# EAGLE board PLA_Controller_combined_Gen2_Rev4 (EAGLE 7.7.0)
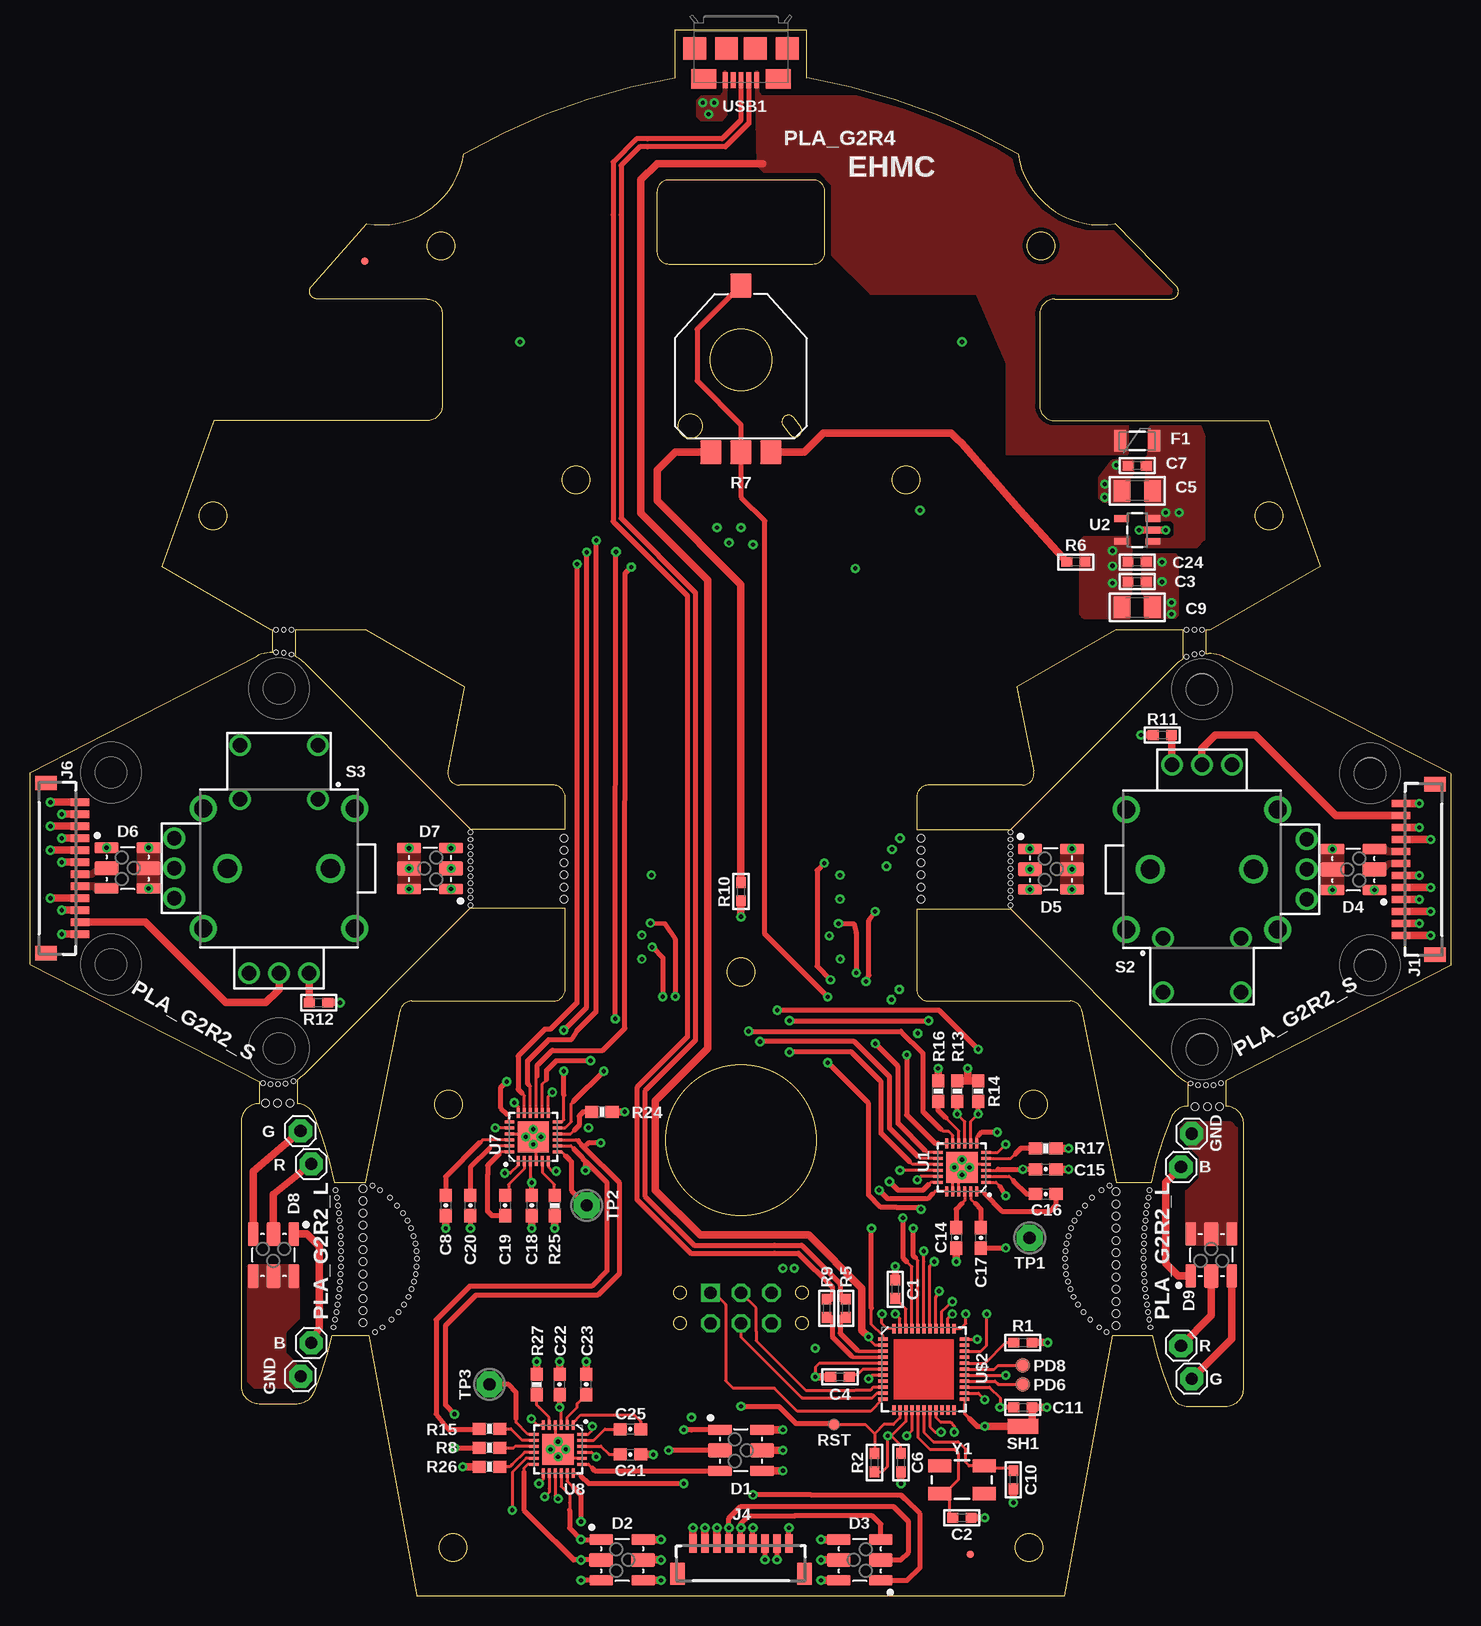
[diagram p6: board, top side]
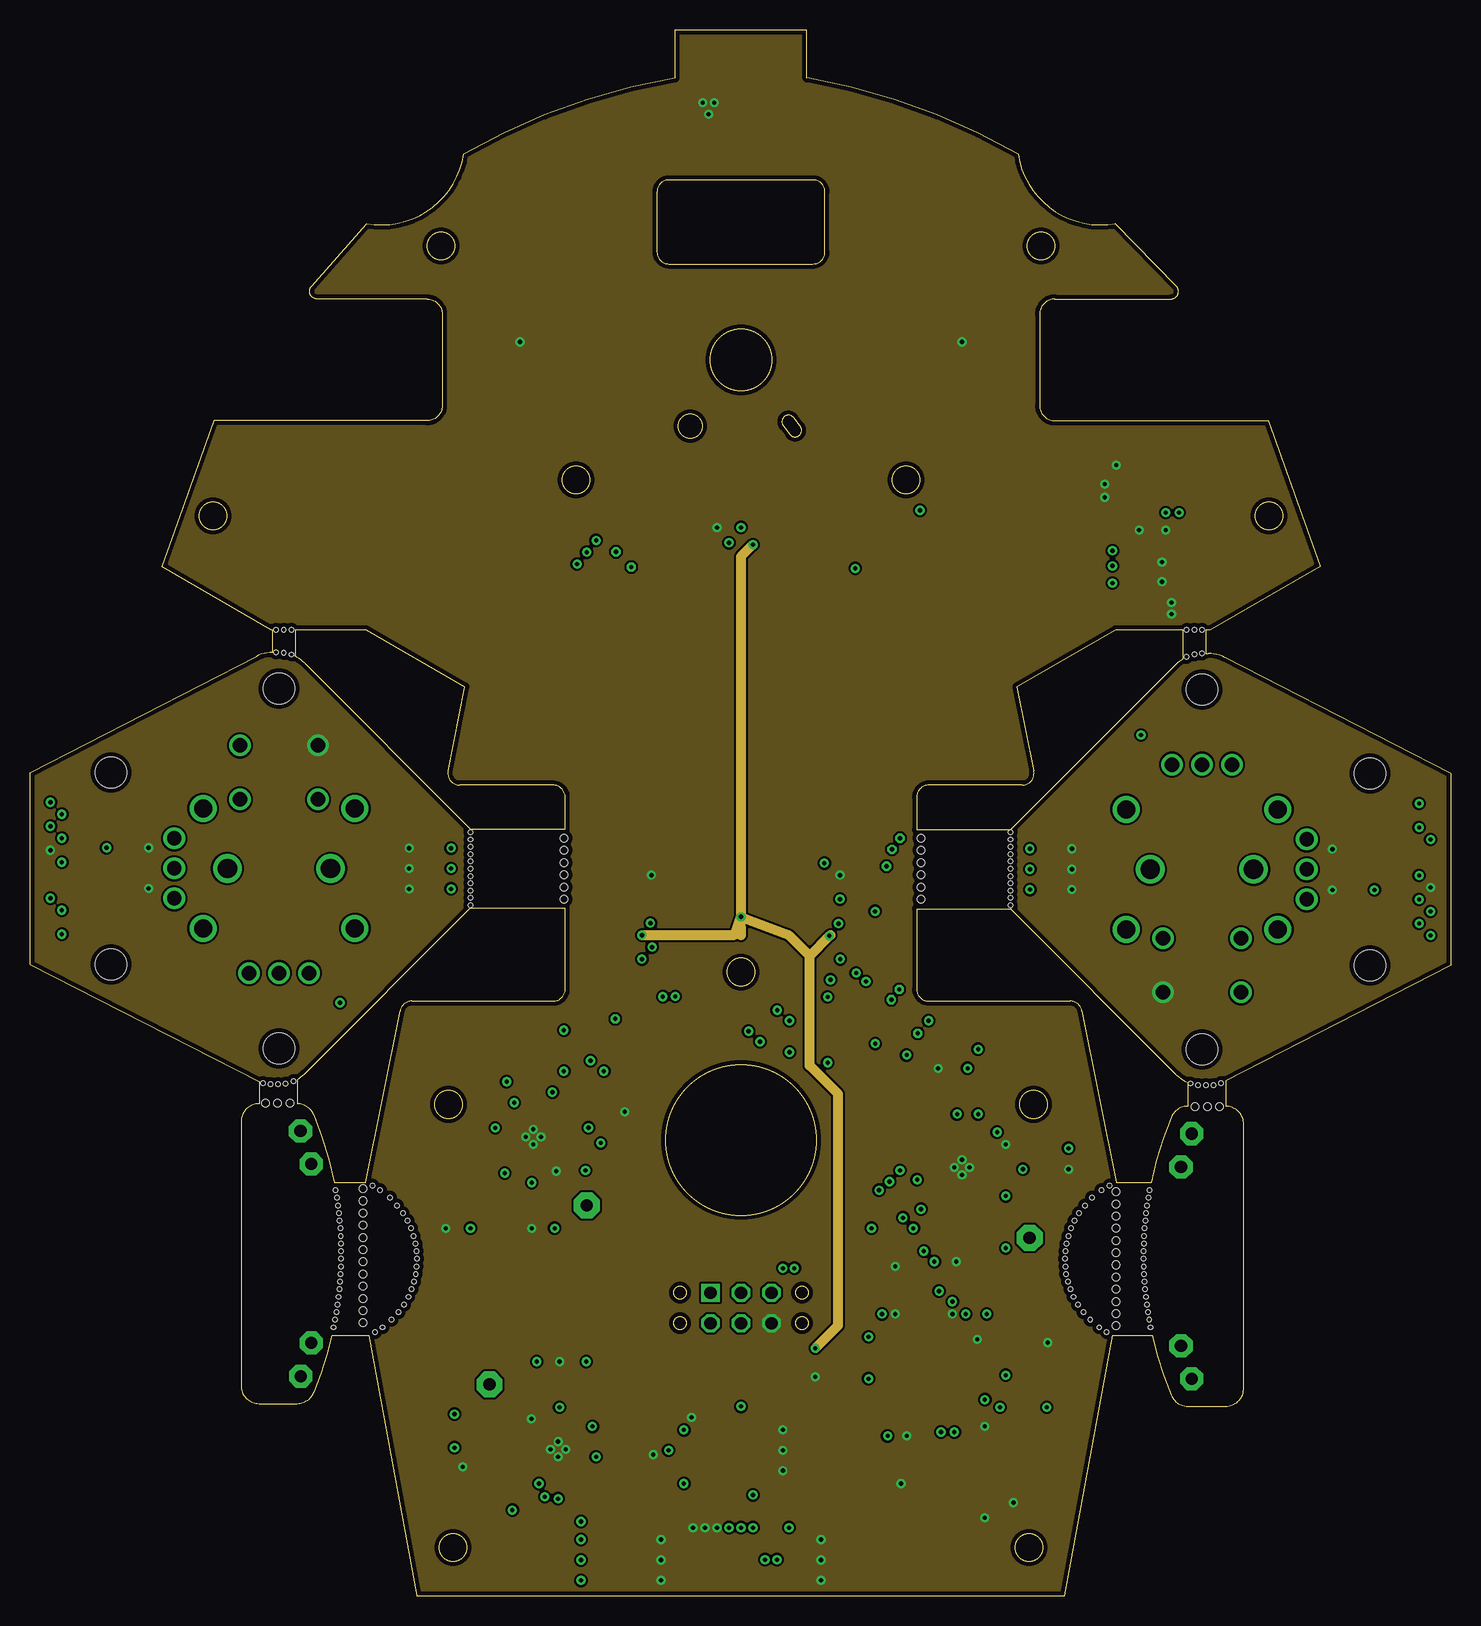
[diagram p7: board, inner layer GND]
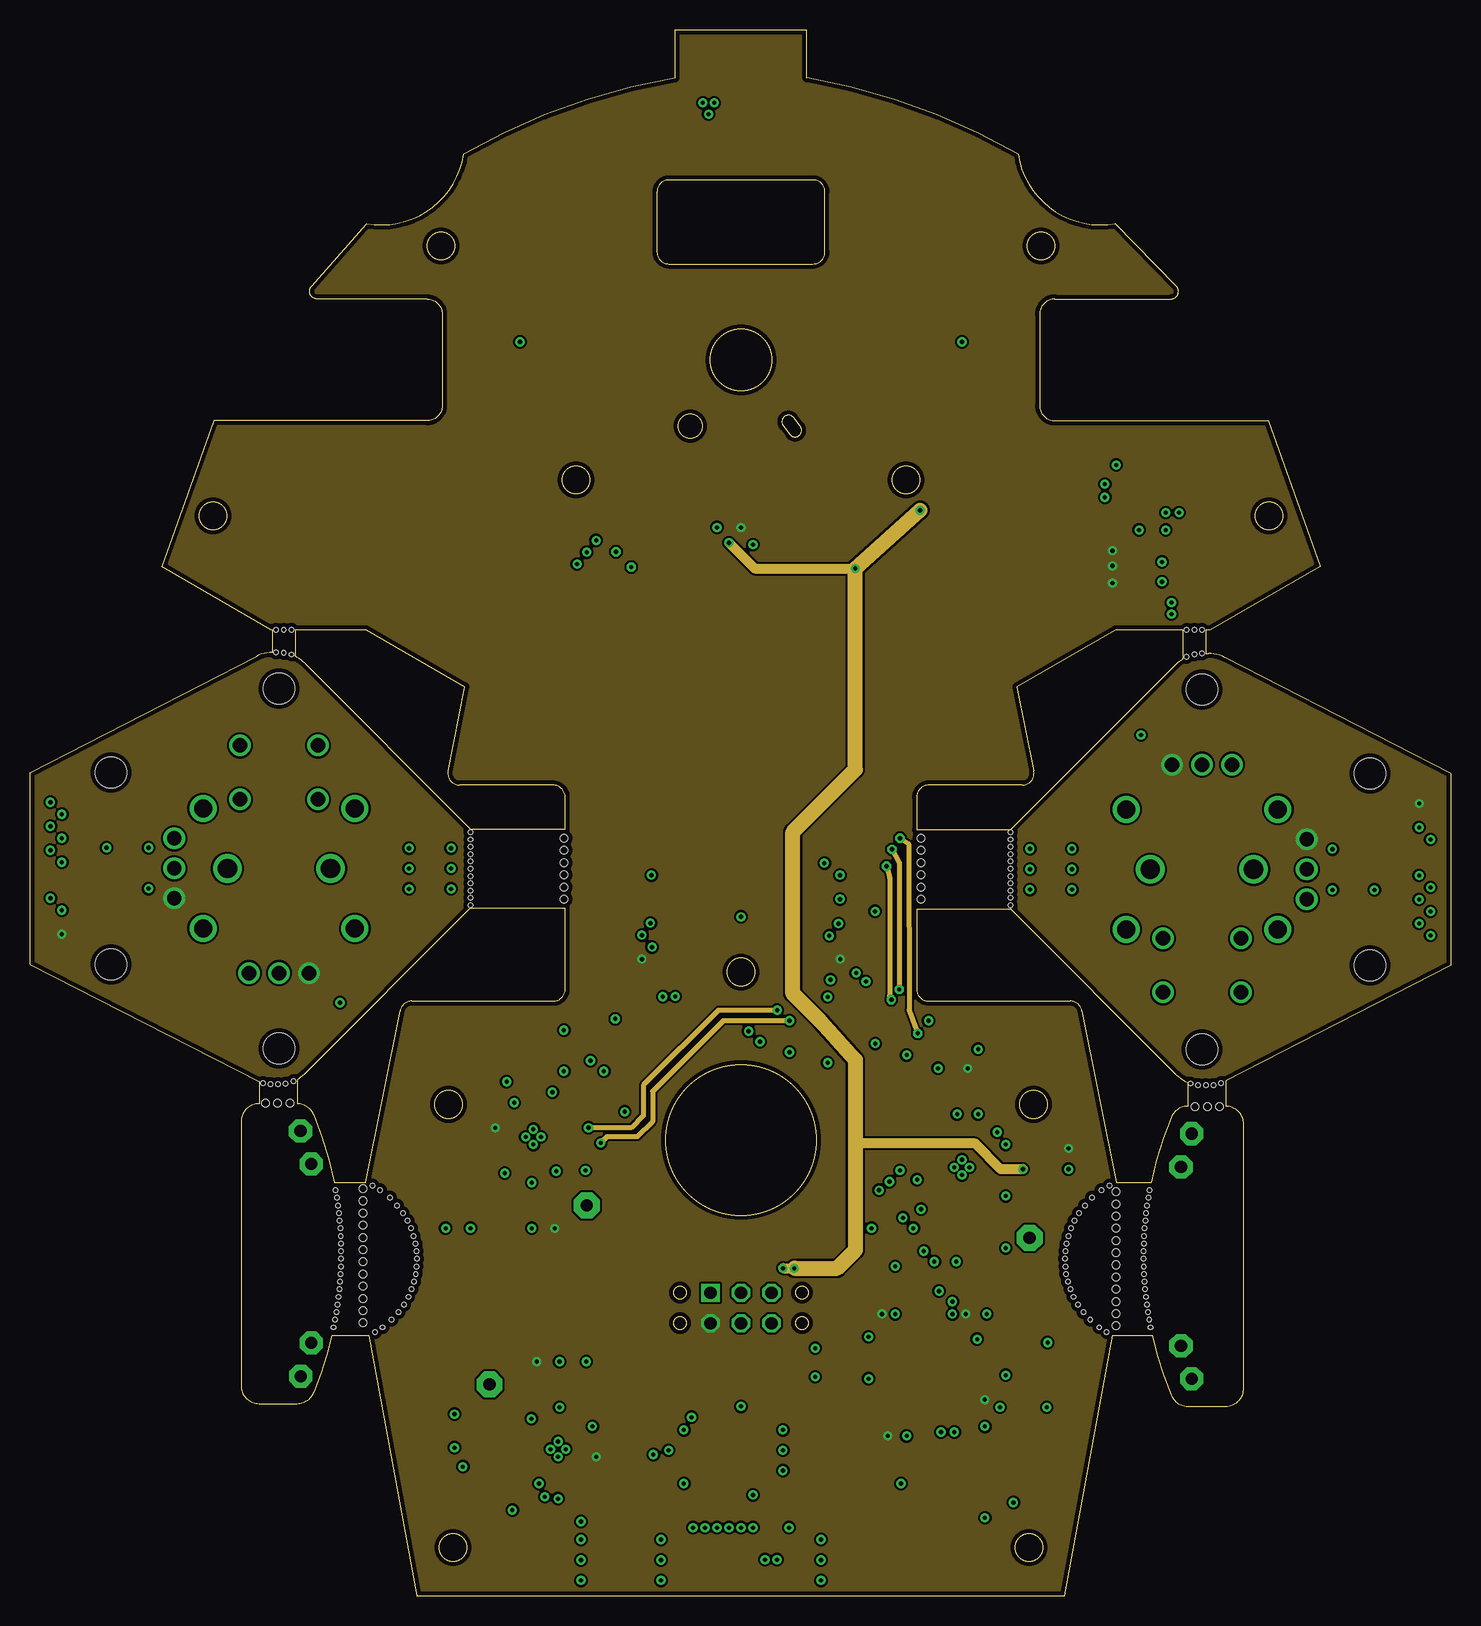
[diagram p8: board, inner layer Route15]
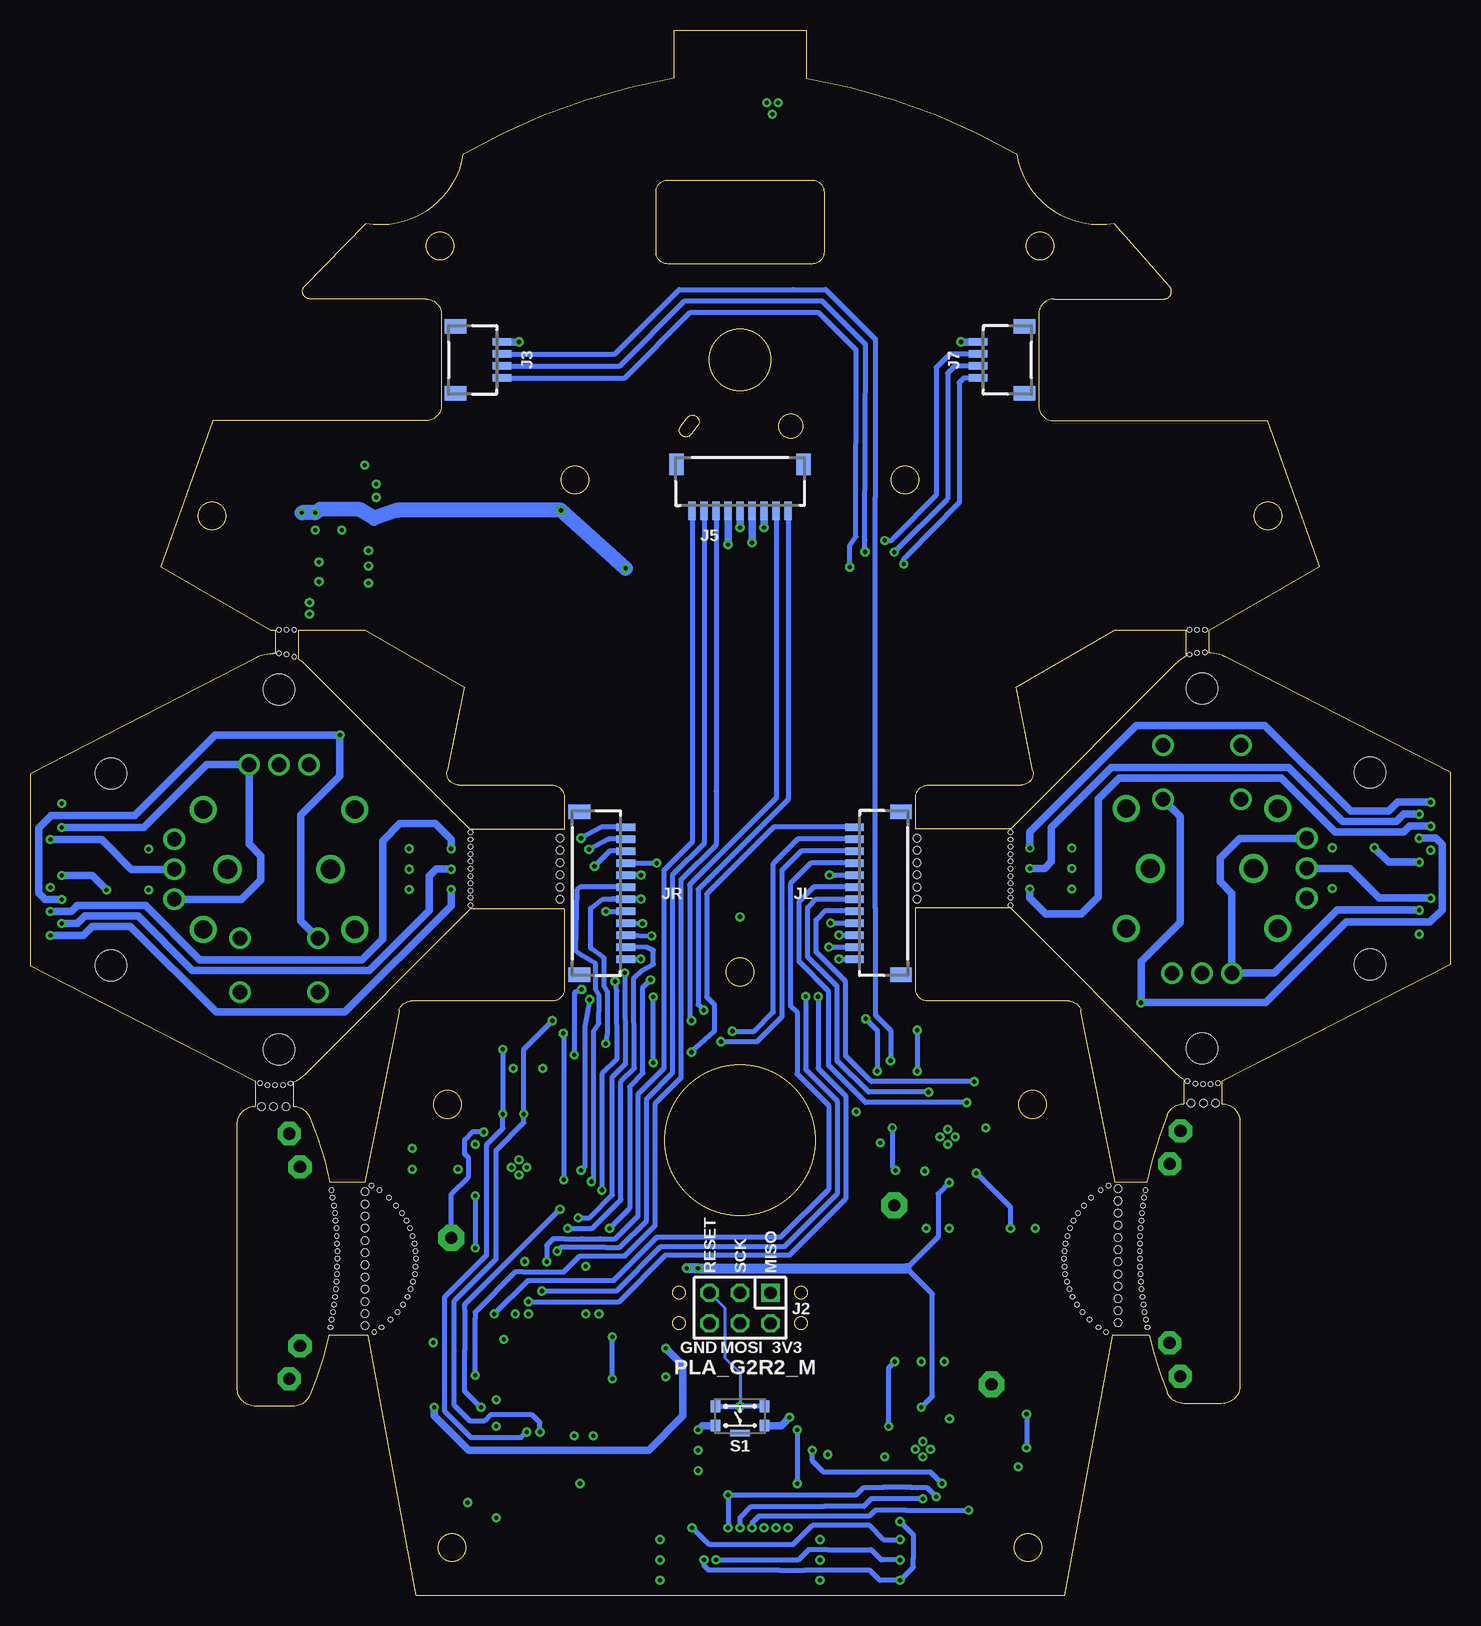
[diagram p9: board, bottom side, seen from below]

Size 118.41 x 130.5 mm. Coordinates in mm from the lower left corner, seen from the top.
Outline: 28.25,21.67 32.25,0 86.25,0 90.25,21.67 93.53,21.67 arc10 95.09,16.71 arc68 96.48,15.78 99.65,15.78 arc90 101.15,17.28 101.15,39.28 arc90 99.65,40.78 99.65,42.91 118.41,52.53 118.41,68.53 99.56,78.2 arc27 98.19,78.53 97.98,78.53 97.98,80.5 98.37,80.5 107.51,85.78 103.19,97.92 85.41,97.92 arc-90 84.14,99.19 84.14,106.81 arc-90 85.41,108.08 95.07,108.08 arc134 95.53,109.16 90.44,114.35 arc-91 82.34,120.13 arc20 64.75,126.5 64.75,130.5 53.75,130.5 53.75,126.5 arc20 36.16,120.13 arc-91 28.05,114.35 23.47,109.16 arc134 23.93,108.08 33.08,108.08 arc-90 34.35,106.81 34.35,99.19 arc-90 33.08,97.92 15.3,97.92 10.98,85.78 20.12,80.5 20.19,80.5 20.19,78.61 arc27 18.86,78.28 0,68.61 0,52.61 19.09,42.84 19.09,40.99 arc90 17.59,39.49 17.59,17.5 arc90 19.09,16 22.26,16 arc68 23.64,16.92 arc10 25.15,21.67 28.25,21.67
Outline: 63.31,96.79 arc180 64.19,97.46 63.64,98.18 arc180 62.77,97.51 63.31,96.79
Outline: 52.25,117 52.25,112 arc90 53.25,111 65.25,111 arc90 66.25,112 66.25,117 arc90 65.25,118 53.25,118 arc90 52.25,117
Outline: 36.25,75.75 28.02,80.5 22.1,80.5 22.1,78.3 arc-18 22.88,77.73 36.7,63.91 44.6,63.91 44.6,66.55 arc90 43.6,67.55 35.82,67.55 arc-101 34.84,68.75 36.25,75.75
Outline: 96.08,80.5 90.47,80.5 82.25,75.75 83.65,68.75 arc-101 82.67,67.55 74.89,67.55 arc90 73.89,66.55 73.89,63.83 81.71,63.83 95.54,77.66 arc-15 96.08,78.08 96.08,80.5
Outline: 73.89,50.55 arc90 74.89,49.55 86.68,49.55 arc-79 87.66,48.75 90.52,34.45 93.43,34.45 arc-11 95.09,39.85 arc-68 96.48,40.78 96.48,42.78 arc-22 95.54,43.41 81.71,57.23 73.89,57.23 73.89,50.55
Outline: 31.82,49.55 arc79 30.84,48.75 27.97,34.45 25.35,34.45 arc11 23.64,40.07 arc68 22.26,40.99 22.26,43.02 arc15 22.88,43.49 36.7,57.31 44.6,57.31 44.6,50.55 arc-90 43.6,49.55 31.82,49.55
Outline: circle at 59.25,103 radius 2.55
Outline: circle at 59.25,37.96 radius 6.25
Outline: circle at 55.02,97.49 radius 1
Outline: circle at 45.5,93 radius 1.15
Outline: circle at 84.25,112.5 radius 1.15
Outline: circle at 103.25,90 radius 1.15
Outline: circle at 15.25,90 radius 1.15
Outline: circle at 83.25,4 radius 1.15
Outline: circle at 59.25,51.97 radius 1.15
Outline: circle at 34.87,40.94 radius 1.15
Outline: circle at 34.25,112.5 radius 1.15
Outline: circle at 35.25,4 radius 1.15
Outline: circle at 83.62,40.94 radius 1.15
Outline: circle at 73,93 radius 1.15
Outline: circle at 64.33,25.23 radius 0.51
Outline: circle at 54.17,25.23 radius 0.51
Outline: circle at 64.33,22.69 radius 0.51
Outline: circle at 54.17,22.69 radius 0.51
Copper layers (1+2*15+16): Top 0.035mm / dielectric 0.3mm / GND 0.035mm / dielectric 0.85mm / Route15 0.035mm / dielectric 0.3mm / Bottom 0.035mm
Design rules "SSC-EAGLE-4Lyr_v1.0.0.3 *": minimum track width 7mil, minimum drill 12mil, track to track 7mil, track to pad 7mil, pad to pad 7mil, via to via 8mil, smd to smd 0mil, copper to edge 15mil, drill to drill 16mil, minimum pad ring 8mil, minimum via ring 8mil, stop-mask expansion 3mil, vias tented up to drill 14mil, thermal gap 10mil
Net classes: 0 default: width 0.203 mm, drill 0.305 mm, clearance 0.178 mm; 1 vcc: width 0.203 mm, drill 0.305 mm, clearance 0.178 mm; 3 diff90: width 0.406 mm, drill 0.356 mm, clearance 0.254 mm
Holes 0.36 mm at 81.71,60.58 81.71,61.19 81.71,61.8 81.71,62.41 81.71,63.02 81.71,63.63 81.71,59.97 81.71,59.36 81.71,58.75 81.71,58.17 81.71,57.53 36.7,63.02 36.7,62.41 36.7,61.8 36.7,61.19 36.7,60.58 36.7,59.97 36.7,59.36 36.7,58.75 36.7,58.17 36.7,57.53 36.7,63.63 20.51,80.5 21.15,80.5 21.78,80.5 20.51,78.62 21.15,78.59 21.78,78.44 97.66,80.5 97.03,80.5 96.39,80.5 97.66,78.54 97.03,78.46 96.39,78.26 96.71,42.69 97.35,42.55 97.98,42.54 98.62,42.56 99.25,42.73 19.4,42.73 20.04,42.62 20.67,42.61 21.31,42.66 21.94,42.87 93.31,33.78 89.31,33.78 88.51,33.15 93.19,33.15 93.09,32.52 87.9,32.52 87.42,31.88 87.05,31.25 86.76,30.61 86.53,29.97 86.37,29.34 86.29,28.7 86.25,28.07 86.27,27.44 86.35,26.8 86.49,26.17 86.7,25.53 86.97,24.89 87.33,24.26 87.78,23.62 88.36,22.99 89.1,22.36 93.02,31.88 92.94,31.25 92.89,30.61 92.85,29.97 92.83,29.34 92.8,28.7 92.8,28.07 92.81,27.44 92.83,26.8 92.88,26.17 92.93,25.53 92.99,24.89 93.07,24.26 93.16,23.62 93.27,22.99 93.38,22.36 25.46,33.78 25.57,33.15 25.66,32.52 25.74,31.88 25.81,31.25 25.86,30.61 25.9,29.97 25.91,29.34 25.93,28.7 25.92,28.07 25.91,27.44 25.88,26.8 25.83,26.17 25.8,25.53 25.72,24.89 25.63,24.26 25.54,23.62 25.43,22.99 25.3,22.36 29.39,22.36 30.14,22.99 30.71,23.62 31.15,24.26 31.52,24.89 31.79,25.53 32.01,26.17 32.15,26.8 32.22,27.44 32.25,28.07 32.21,28.7 32.12,29.34 31.97,29.97 31.74,30.61 31.45,31.25 31.07,31.88 29.99,33.15 29.19,33.78 30.6,32.52 28.53,34.18 28.77,21.96 89.97,34.18 89.73,21.96
Holes 0.61 mm at 27.75,33.91 27.75,32.9 27.75,31.88 27.75,30.86 27.75,29.85 27.75,28.83 27.75,27.82 27.75,26.8 27.75,25.78 27.75,24.77 27.75,23.75 27.75,22.74 90.49,33.66 90.49,32.64 90.49,31.63 90.49,30.61 90.49,29.59 90.49,28.58 90.49,27.56 90.49,26.55 90.49,25.53 90.49,24.51 90.49,23.5 90.49,22.48 97.09,40.77 98.11,40.77 99.12,40.77 19.62,41.02 20.64,41.02 21.65,41.02 44.51,63.12 44.51,62.11 44.51,61.09 44.51,60.07 44.51,59.06 44.51,58.04 74.23,63.12 74.23,62.11 74.23,61.09 74.23,60.07 74.23,59.06 74.23,58.04
bKeepout: area 78,0.1 to 90.2,22.4; area 28.3,0.1 to 40.5,22.4; area 48.5,16.7 to 70,31.2; area 28,31.5 to 39.6,46.5; area 78.9,31.5 to 90.5,46.5; area 11.6,85.5 to 20.8,93.8; area 97.7,85.5 to 106.9,93.8
tRestrict: area -52.6,-44.7 to -51.9,-44.6; area 13.2,88 to 17.2,92; area 101.2,88 to 105.2,92; area 57.2,50 to 61.2,54; area 32.9,38.9 to 36.9,42.9; area 81.6,38.9 to 85.6,42.9; area 81.2,2 to 85.2,6; area 33.2,2 to 37.2,6
bRestrict: area 13.2,88 to 17.2,92; area 101.2,88 to 105.2,92; area 57.2,50 to 61.2,54; area 32.9,38.9 to 36.9,42.9; area 81.6,38.9 to 85.6,42.9; area 81.2,2 to 85.2,6; area 33.2,2 to 37.2,6

## Footprints (pad centres in the part's own frame; a part is rotated, then mirrored left to right if it is on the bottom)
1X01 = drill 1.016 pad 1.93 octagon: 1 0,0
C0603 = smd 0.9 x 0.8: 1 -0.762,0; 2 0.762,0
C1206 = smd 1.4 x 1.8: 1 -1.27,0; 2 1.27,0
0603-CAP = smd 1.1 x 1: 1 -0.85,0; 2 0.85,0
XZFBBM2ACRDG92W-3 = smd 2 x 0.9: 1 -1.75,1.7; 3 -1.75,-1.7; 4 1.75,1.7; 6 1.75,-1.7 | smd 2 x 1.2: 2 -1.75,0; 5 1.75,0
PTC-1206 = smd 1 x 1.8: 1 -1.4,0; 2 1.4,0
SM12B-SSR-H-TB = smd 0.6 x 1.55: 1 -5.5,1.925; 2 -4.5,1.925; 3 -3.5,1.925; 4 -2.5,1.925; 5 -1.5,1.925; 6 -0.5,1.925; 7 0.5,1.925; 8 1.5,1.925; 9 2.5,1.925; 10 3.5,1.925; 11 4.5,1.925; 12 5.5,1.925 | smd 1.2 x 1.8: FIT@1 -7.1,-0.9; FIT@2 7.1,-0.9
DIL-100-2X03 = drill 1.016 square: 1 -2.54,-1.27 | drill 1.016 octagon: 2 -2.54,1.27; 3 0,-1.27; 4 0,1.27; 5 2.54,-1.27; 6 2.54,1.27
SM04B-SRSS-TB = smd 0.6 x 1.55: 1 -1.5,2.975; 2 -0.5,2.975; 3 0.5,2.975; 4 1.5,2.975 | smd 1.2 x 1.8: FIT@1 -2.8,-0.9; FIT@2 2.8,-0.9
BM09B-SRSS-TB = smd 0.6 x 1.55: 1 -4,-1.625; 2 -3,-1.625; 3 -2,-1.625; 4 -1,-1.625; 5 0,-1.625; 6 1,-1.625; 7 2,-1.625; 8 3,-1.625; 9 4,-1.625 | smd 1.2 x 1.8: FIT@1 5.3,0.9; FIT@2 -5.3,0.9
SM09B-SRSS-TB = smd 0.6 x 1.55: 1 -4,2.975; 2 -3,2.975; 3 -2,2.975; 4 -1,2.975; 5 0,2.975; 6 1,2.975; 7 2,2.975; 8 3,2.975; 9 4,2.975 | smd 1.2 x 1.8: FIT@1 -5.3,-0.9; FIT@2 5.3,-0.9
SM12B-SRSS-TB = smd 0.6 x 1.55: 1 -5.5,2.975; 2 -4.5,2.975; 3 -3.5,2.975; 4 -2.5,2.975; 5 -1.5,2.975; 6 -0.5,2.975; 7 0.5,2.975; 8 1.5,2.975; 9 2.5,2.975; 10 3.5,2.975; 11 4.5,2.975; 12 5.5,2.975 | smd 1.2 x 1.8: FIT@1 -6.8,-0.9; FIT@2 6.8,-0.9
MICRO-FIDUCIAL = smd 0.635 x 0.635: 1 0,0
SMD12R = smd 1.2 x 1.2: PAD 0,0
R0603 = smd 0.9 x 0.8: 1 -0.762,0; 2 0.762,0
SV01A103AEA01R00 = smd 1.8 x 2: 1 -2.5,-7.7; 2 0,-7.7; 2A 0,6.2; 3 2.5,-7.7
0603-RES = smd 1.1 x 1: 1 -0.85,0; 2 0.85,0
SMD10R = smd 1 x 1: PAD 0,0
KMR211GLFS = smd 0.9 x 1: 1A -2.05,0.8; 1B 2.05,0.8; 2A -2.05,-0.8; 2B 2.05,-0.8 | smd 1.7 x 0.55: M 0,1.425
RKJXV1224005 = drill 1.2 pad 1.8: 1 -3.25,-5.75; 2 -3.25,-10.25; 3 3.25,-5.75; 4 3.25,-10.25; 5 8.73,-2.5; 6 8.73,0; 7 8.73,2.5; 8 2.5,8.73; 9 0,8.73; 10 -2.5,8.73 | drill 1.5 pad 2.25: 11 -6.325,5; 12 6.325,5; 15 -6.325,-5; 16 6.325,-5 | drill 1.6 pad 2.4: 13 -4.3,0; 14 4.3,0
SHORT_TOP-50 = smd 1.295 x 1.27: 1 0.635,0; 2 -0.635,0
TP-040 = drill 1.016 pad 2.159 octagon: 1 0,0
WQFN-24 = smd 0.8 x 0.25: 1 -2,1.25; 2 -2,0.75; 3 -2,0.25; 4 -2,-0.25; 5 -2,-0.75; 6 -2,-1.25; 13 2,-1.25; 14 2,-0.75; 15 2,-0.25; 16 2,0.25; 17 2,0.75; 18 2,1.25 | smd 0.25 x 0.8: 7 -1.25,-2; 8 -0.75,-2; 9 -0.25,-2; 10 0.25,-2; 11 0.75,-2; 12 1.25,-2; 19 1.25,2; 20 0.75,2; 21 0.25,2; 22 -0.25,2; 23 -0.75,2; 24 -1.25,2 | smd 2.6 x 2.6: EP 0,0
SOT23-5 = smd 0.55 x 1.2: 1 -0.95,-1.3; 2 0,-1.3; 3 0.95,-1.3; 4 0.95,1.3; 5 -0.95,1.3
QFN-44 = smd 0.8 x 0.3: 1 -3.4,2.5; 2 -3.4,2; 3 -3.4,1.5; 4 -3.4,1; 5 -3.4,0.5; 6 -3.4,0; 7 -3.4,-0.5; 8 -3.4,-1; 9 -3.4,-1.5; 10 -3.4,-2; 11 -3.4,-2.5; 23 3.4,-2.5; 24 3.4,-2; 25 3.4,-1.5; 26 3.4,-1; 27 3.4,-0.5; 28 3.4,0; 29 3.4,0.5; 30 3.4,1; 31 3.4,1.5; 32 3.4,2; 33 3.4,2.5 | smd 0.3 x 0.8: 12 -2.5,-3.4; 13 -2,-3.4; 14 -1.5,-3.4; 15 -1,-3.4; 16 -0.5,-3.4; 17 0,-3.4; 18 0.5,-3.4; 19 1,-3.4; 20 1.5,-3.4; 21 2,-3.4; 22 2.5,-3.4; 34 2.5,3.4; 35 2,3.4; 36 1.5,3.4; 37 1,3.4; 38 0.5,3.4; 39 0,3.4; 40 -0.5,3.4; 41 -1,3.4; 42 -1.5,3.4; 43 -2,3.4; 44 -2.5,3.4
101-NS = hole 2.578: 0,0
10118192-0001LF = smd 0.4 x 1.35: 1 -1.3,4.1; 2 -0.65,4.1; 3 0,4.1; 4 0.65,4.1; 5 1.3,4.1 | smd 1.9 x 1.9: M1 -1.2,1.45; M2 1.2,1.45; S1 -3.85,1.45; S2 3.85,1.45 | smd 2.1 x 1.6: S3 -3.1,4; S4 3.1,4
CRYSTAL-SMD-5X3 = smd 1.9 x 1.1: 1 -1.85,-1.15; 2 1.85,-1.15; 3 1.85,1.15; 4 -1.85,1.15

## Placement (x,y rotation side)
B1  [1X01]  23.45,21.05 180 top
B2  [1X01]  95.92,35.72 0 top
C1  0.1uf  [C0603]  72.11,25.53 90 top
C2  22P  [C0603]  77.66,6.48 0 top
C3  1U  [C0603]  92.27,84.51 180 top
C4  1U  [C0603]  67.5,18.23 0 top
C5  10U  [C1206]  92.27,92.09 0 top
C6  1U  [C0603]  72.58,11.08 90 top
C7  4.7U  [C0603]  92.27,94.18 0 top
C8  1.0uF  [0603-CAP]  34.64,32.52 270 top
C9  10U  [C1206]  92.27,82.38 180 top
C10  22P  [C0603]  81.95,9.66 270 top
C11  0.1uf  [C0603]  82.74,15.69 0 top
C14  1.0uF  [0603-CAP]  77.19,29.82 270 top
C15  1.0uF  [0603-CAP]  84.65,35.53 0 top
C16  0.47uf  [0603-CAP]  84.65,33.47 0 top
C17  0.47uf  [0603-CAP]  79.25,29.82 90 top
C18  1.0uF  [0603-CAP]  41.82,32.52 270 top
C19  0.47uf  [0603-CAP]  39.59,32.52 270 top
C20  0.47uf  [0603-CAP]  36.7,32.52 90 top
C21  1.0uF  [0603-CAP]  50.04,11.75 0 top
C22  1.0uF  [0603-CAP]  44.13,17.59 90 top
C23  0.47uf  [0603-CAP]  46.36,17.59 90 top
C24  0.1uf  [C0603]  92.27,86.15 0 top
C25  0.47uf  [0603-CAP]  50.04,13.87 180 top
D1  [XZFBBM2ACRDG92W-3]  59.25,12.11 0 top
D2  [XZFBBM2ACRDG92W-3]  49.35,2.96 0 top
D3  [XZFBBM2ACRDG92W-3]  69.15,2.96 180 top
D4  [XZFBBM2ACRDG92W-3]  110.28,60.52 180 top
D5  [XZFBBM2ACRDG92W-3]  85.07,60.55 0 top
D6  [XZFBBM2ACRDG92W-3]  8.13,60.63 0 top
D7  [XZFBBM2ACRDG92W-3]  33.34,60.6 180 top
D8  [XZFBBM2ACRDG92W-3]  20.29,28.38 270 top
D9  [XZFBBM2ACRDG92W-3]  98.44,28.39 90 top
F1  500mA  [PTC-1206]  92.27,96.24 0 top
G1  [1X01]  22.54,38.72 180 top
G2  [1X01]  96.81,18.07 0 top
GND51  [1X01]  22.56,18.28 180 top
GND54  [1X01]  96.81,38.49 0 top
J1  [SM12B-SSR-H-TB]  116.18,60.52 90 top
J2  [DIL-100-2X03]  59.25,23.96 180 bottom
J3  [SM04B-SRSS-TB]  82.05,103 270 bottom
J4  [BM09B-SRSS-TB]  59.25,2.71 180 top
J5  [SM09B-SRSS-TB]  59.25,93.39 180 bottom
J6  [SM12B-SSR-H-TB]  2.24,60.63 270 top
J7  [SM04B-SRSS-TB]  36.45,103 90 bottom
JL  [SM12B-SRSS-TB]  46.75,58.55 90 bottom
JP1  FIDUCIALUFIDUCIAL  [MICRO-FIDUCIAL]  27.88,111.23 270 top
JP2  FIDUCIALUFIDUCIAL  [MICRO-FIDUCIAL]  78.34,3.45 0 top
JR  [SM12B-SRSS-TB]  71.75,58.55 270 bottom
PD6  PAD-SMD12R  [SMD12R]  82.74,17.59 0 top
PD8  PAD-SMD12R  [SMD12R]  82.74,19.18 0 top
R1  10K  [R0603]  82.74,21.08 0 top
R2  10K  [R0603]  70.38,11.08 90 top
R5  22  [R0603]  67.98,23.94 270 top
R6  220  [R0603]  87.15,86.15 0 top
R7  [SV01A103AEA01R00]  59.25,103 0 top
R8  [0603-RES]  38.29,12.32 180 top
R9  22  [R0603]  66.39,23.94 270 top
R10  220  [R0603]  59.25,58.68 90 top
R11  10K  [R0603]  94.37,71.73 0 top
R12  10K  [R0603]  24.04,49.42 180 top
R13  4.7K  [0603-RES]  77.27,42.04 90 top
R14  4.7K  [0603-RES]  79.01,42.04 90 top
R15  [0603-RES]  38.29,13.91 180 top
R16  150K  [0603-RES]  75.68,42.04 90 top
R17  150K  [0603-RES]  84.65,37.28 0 top
R18  [1X01]  23.44,35.97 180 top
R19  [1X01]  95.92,20.82 0 top
R24  150K  [0603-RES]  47.66,40.33 0 top
R25  150K  [0603-RES]  43.72,32.52 270 top
R26  150K  [0603-RES]  38.29,10.73 180 top
R27  150K  [0603-RES]  42.23,17.59 90 top
RST  PAD-SMD10R  [SMD10R]  67,14.26 0 top
S1  [KMR211GLFS]  59.25,14.96 180 bottom
S2  [RKJXV1224005]  97.66,60.53 0 top
S3  [RKJXV1224005]  20.75,60.61 180 top
SH1  SHORTT5  [SHORT_TOP-50]  82.74,14.1 0 top
TP1  TP-040  [TP-040]  83.3,29.82 180 top
TP2  TP-040  [TP-040]  46.39,32.52 90 top
TP3  TP-040  [TP-040]  38.29,17.59 270 top
U1  [WQFN-24]  77.66,35.69 180 top
U2  [SOT23-5]  92.27,88.82 90 top
U7  [WQFN-24]  41.94,38.23 90 top
U8  [WQFN-24]  44.01,12.19 270 top
U$2  [QFN-44]  74.49,18.86 0 top
U$3  [FAB_FRAME_ANSI-A]  -70.33,-67.91 0 top  (outside the outline)
U$4  [FAB_DOCFIELD_GENERIC]  84.44,-67.68 0 top  (outside the outline)
U$6  [101-NS]  111.66,52.53 270 top
U$7  [101-NS]  97.66,45.53 270 top
U$8  [101-NS]  111.66,68.53 270 top
U$9  [101-NS]  97.66,75.53 270 top
U$11  [101-NS]  6.75,68.61 90 top
U$12  [101-NS]  20.75,75.61 90 top
U$13  [101-NS]  6.75,52.61 90 top
U$15  [101-NS]  20.75,45.61 90 top
USB1  [10118192-0001LF]  59.25,130.41 180 top
Y1  8MHz  [CRYSTAL-SMD-5X3]  77.66,9.66 0 top

## Tracks (layer width: path | path; a pad name or v marks a point on that pad's centre or on a via)
3V3  (via drill 0.36)
  Top 0.254: U8.21 46.8,11.94 v47.18,11.56 | U$2.14 72.99,14.5 71.79,13.31 | C6.2 72.58,12.51 71.79,13.31 | 71.79,13.31 v71.47,13.31 71.47,10.77 71.03,10.32 R2.1 | U$2.24 79.03,16.86 v79.57,16.32 | U$2.44 71.4,22.26 70.99,22.67 v70.99,23.47 | U$2.34 77.57,22.26 77.98,22.67 v77.98,23.47 | U7.20 v38.77,38.98
  Top 0.61: R27.2 v42.23,19.5 | R25.2 v43.72,30.61 | R14.2 78.14,42.89 | 78.14,42.89 R13.2 | v86.55,37.28 R17.2 | v78.14,43.95 78.14,42.89
  Bottom 0.406: v50.99,53.05 JL.1 | JR.12 v67.52,53.05
  Bottom 0.61: v59.25,89.03 J5.5
  other vias: 90.2,87.09 90.2,84.39 90.2,85.82
  pour Route15 (rank 2, no thermals): 32.1,-0.19 28.05,21.64 28.05,21.8 28.21,21.88 29.16,22.43 29.96,23.07 30.51,23.7 30.99,24.34 31.47,25.29 31.78,26.24 31.94,26.96 32.02,27.59 32.02,28.94 31.78,29.74 31.62,30.45 31.23,31.25 30.59,32.12 30.2,32.67 29.8,33.07 29.24,33.47 28.77,33.86 28.29,34.1 27.81,34.26 27.81,34.58 30.83,49.18 31.15,49.5 31.7,49.74 43.85,49.74 44.25,50.06 44.4,50.53 44.4,66.73 44.32,66.96 44.01,67.28 43.69,67.36 35.51,67.36 34.96,67.6 34.64,68 34.56,68.47 36.07,75.69 27.97,80.3 20.04,80.3 10.75,85.78 arc-41 27.63,114.31 27.97,114.59 28.29,114.51 29.24,114.43 30.2,114.51 31.47,114.83 31.94,114.99 32.81,115.46 33.29,115.78 33.69,116.1 34.09,116.49 34.56,117.05 35.36,118.32 35.83,119.59 35.99,120.22 36.15,120.38 arc-34 52.52,126.59 53.53,126.65 53.53,130.7 64.96,130.7 64.96,126.65 65.87,126.57 arc-30 82.5,120.3 82.66,119.43 82.9,118.72 83.22,118.08 83.62,117.45 84.25,116.65 84.73,116.18 85.28,115.78 85.92,115.38 86.55,115.06 87.35,114.75 88.14,114.59 88.93,114.51 90.84,114.51 93.31,112.11 arc-33 107.53,86.6 107.75,85.62 98.38,80.22 90.52,80.22 82.5,75.62 83.93,68.47 83.77,68 83.54,67.68 83.06,67.36 74.8,67.36 74.57,67.28 74.25,67.04 74.09,66.65 74.09,50.3 74.33,49.98 74.57,49.82 74.88,49.74 87.11,49.74 87.5,49.42 87.74,49.1 90.68,34.5 90.68,34.34 89.73,33.78 89.09,33.39 88.38,32.67 87.66,31.8 87.27,31.09 86.87,30.29 86.63,29.42 86.47,28.47 86.47,27.36 86.79,26.01 87.11,25.05 87.74,24.02 88.3,23.39 88.85,22.83 89.33,22.43 89.97,22.04 90.44,21.72 86.39,-0.19
  pour Top (no thermals): 91.63,88.2 87.82,88.2 87.5,87.89 87.5,81.85 87.82,81.54 91.63,81.54 91.63,83.44 91.79,83.6 91.79,87.41 91.63,87.57
3V3_STICK  (via drill 0.36)
  Top 0.61: J1.12 v115.76,66.02 | R11.2 95.16,71.69 S2.10
  pour Route15 (rank 2, no thermals): 118.94,68.87 98.86,79.11 96.16,79.11 81.15,63.95 81.15,57.2 96.24,42.04 98.7,41.96 118.94,52.2
3V3_STICK2  (via drill 0.36)
  Top 0.61: J6.12 v2.65,55.13 | R12.2 23.25,49.45 S3.10
  pour Route15 (rank 2, no thermals): -0.52,52.28 19.56,42.04 22.26,42.04 37.26,57.2 37.26,63.95 22.18,79.11 19.72,79.19 -0.52,68.95
AREF
  Top 0.254: U$2.42 72.99,23.89 C1.1
B1  (via drill 0.36)
  Top 0.254: U1.18 75.06,34.44 74.88,34.26
  Top 0.406: v71.63,34.5 72.34,33.78 74.41,33.78 74.88,34.26
  Bottom 0.406: v71.63,34.5 71.47,34.66 71.47,47.04 71.02,47.7 70.98,49.61 70.98,50.02 71.29,50.52 71.29,52 71.27,52.68 72.47,53.39 72.96,53.77 72.85,58.81 72.56,59.06 69.3,59.05 JR.6
B1_1LED
  Top 0.61: B1.1 24.08,22.32 24.08,29.1 23.05,30.13 D8.1
B1_1LED2
  Top 0.61: B2.1 94.65,34.45 94.65,28.31 94.65,27.67 95.68,26.64 D9.1
B1_STICK  (via drill 0.36)
  Top 0.61: J1.6 v115.76,60.02
  Bottom 0.61: D4.1 113.23,60.02 v115.76,60.02
  other vias: 112.03,58.82
B1_STICK2  (via drill 0.36)
  Top 0.61: J6.6 v2.65,61.13
  Bottom 0.61: D6.1 5.18,61.13 v2.65,61.13
  other vias: 6.38,62.33
B2  (via drill 0.36)
  Top 0.254: U1.16 v72.5,35.44
  Route15 0.406: v71.38,60.79 71.64,59.82 71.64,50.02 v71.78,49.67
  Bottom 0.406: v72.5,35.44 72.18,35.76 72.18,47.44 v71.78,49.67 | JR.3 70.11,62.05 v71.38,60.79
B2_STICK  (via drill 0.36)
  Top 0.61: J1.3 v116.71,57.02
  Bottom 0.61: v116.71,57.02 114.99,57.02 114.49,57.52 108.78,57.52 104.25,52.99 102.82,52.99 97.35,52.99 90.76,52.99 89.01,54.74 89.01,62.92 87.58,64.34 84.65,64.34 83.32,63.02 D5.1
  other vias: 83.32,62.25
B2_STICK2  (via drill 0.36)
  Top 0.61: J6.3 v1.7,64.13
  Bottom 0.61: v1.7,64.13 3.42,64.13 3.92,63.63 9.64,63.63 14.16,68.15 15.59,68.15 21.07,68.15 27.66,68.15 29.4,66.41 29.4,58.23 30.83,56.8 33.77,56.8 35.09,58.13 D7.1
  other vias: 35.09,58.9
B3  (via drill 0.36)
  Top 0.254: U1.14 74.13,36.44 73.93,36.64
  Top 0.406: 73.93,36.64 71.63,38.94 71.63,43.23 68.69,46.17 v60.83,46.17
  Bottom 0.406: JL.10 54.16,62.05 55.75,60.45 55.75,48.23 57.82,46.17 v60.83,46.17
B4  (via drill 0.36)
  Top 0.254: U7.18 40.69,40.75 v40.36,41.09
  Bottom 0.406: JL.7 53.11,59.05 54.33,57.84 54.33,52.84 51.86,50.37 51.86,44.18 48.77,41.09 v40.36,41.09
B5  (via drill 0.36)
  Top 0.254: U7.16 41.69,42.45 41.55,42.6
  Top 0.406: v47.18,87.95 47.18,48.71 45.59,47.12 45.09,46.33 43.21,46.33 41.47,44.58 41.47,42.67 41.55,42.6
  Bottom 0.406: J7.3 41.76,103.5 42.9,102.36 42.9,91.73 46.29,88.27 46.61,87.95 v47.18,87.95
B6  (via drill 0.36)
  Top 0.254: U7.14 42.69,42.63 43.05,42.99
  Top 0.406: v46.71,44.58 43.85,44.58 43.05,43.79 43.05,42.99
  Bottom 0.406: J3.2 69.7,103.5 64.33,108.87 54.8,108.87 52.1,108.87 47.98,104.75 47.98,91.57 47.98,57.28 47.98,48.39 46.71,47.12 v46.71,44.58
B7  (via drill 0.36)
  Top 0.254: U8.18 45.69,10.19 45.91,9.97
  Top 0.406: D1.1 55.14,13.81 v54.48,13.81 | 45.91,9.97 46.55,9.34 v54.48,9.34
  Bottom 0.406: v54.48,13.81 54.48,9.66 v54.48,9.34
B8  (via drill 0.36)
  Top 0.254: U8.16 44.26,9.09 44.96,8.39 44.96,7.75 44.96,7.11
  Top 0.406: J4.1 v63.25,5.65 | D2.1 v45.91,4.66 44.96,5.61 44.96,7.11
  Bottom 0.406: v63.25,5.65 61.85,4.26 54.8,4.26 53.21,5.84 48.45,5.84 47.27,4.66 v45.91,4.66
B9  (via drill 0.36)
  Top 0.254: U8.14 43.26,8.91 43.26,8.59 v42.9,8.23
  Top 0.406: D3.1 73.08,1.26 74.17,2.35 74.17,6.8 72.9,8.07 72.58,8.39 65.12,8.39 v60.25,8.39 | J4.4 v60.25,5.65
  Bottom 0.406: v60.25,5.65 v60.25,8.39 49.56,8.39 48.93,9.02 47.34,9.02 44.96,9.02 43.69,9.02 v42.9,8.23
D8
  Top 0.254: U$2.28 80.36,18.86 80.68,19.18 PD8.PAD
D12
  Top 0.254: U$2.26 80.41,17.86 80.68,17.59 PD6.PAD
D+
  Top 0.254: 68.57,19.86 68.53,19.89
  Top 0.305: U$2.4 69.57,19.86 68.57,19.86 | 68.53,19.89 68.45,19.97
  Top 0.406: R9.2 66.85,23.18 66.85,22.43 66.85,21.57 68.45,19.97
D-
  Top 0.254: 69.02,20.36 68.93,20.45
  Top 0.305: U$2.3 69.57,20.36 69.02,20.36
  Top 0.406: R5.2 67.51,23.18 67.51,22.36 67.51,21.87 68.93,20.45
G1  (via drill 0.36)
  Top 0.254: U1.19 75.42,33.69 75.2,33.47
  Top 0.406: v70.76,33.78 71.47,33.07 74.8,33.07 75.2,33.47 | v69.66,51.18 69.91,51.69 69.91,56.26 v70.42,57.03
  Bottom 0.406: v70.76,33.78 70.76,43.47 69.49,44.74 69.51,50.42 v69.66,51.18 | JR.8 69.41,57.04 v70.42,57.03
G1_1LED
  Top 0.61: D8.3 18.59,35.37 G1.1
G1_1LED2
  Top 0.61: D9.3 100.14,21.41 G2.1
G1_STICK
  pour Top (no thermals): 114.89,62.2 113.22,62.2 112.9,62.52 111.16,62.52 111.16,61.89 112.98,61.89 113.06,61.85 114.89,61.85
G1_STICK2
  pour Top (no thermals): 3.53,58.95 5.19,58.95 5.51,58.63 7.26,58.63 7.26,59.25 5.43,59.25 5.35,59.3 3.53,59.3
G2  (via drill 0.36)
  Top 0.254: U1.17 74.21,34.94 v73.93,34.66
  Route15 0.406: v72.5,63.12 73.22,62.66 73.26,48.79 v73.98,46.87
  Bottom 0.406: v73.93,34.66 73.93,46.39 v73.98,46.87 | JR.1 70.81,64.05 v72.5,63.12
G2_STICK  (via drill 0.36)
  Top 0.61: J1.1 v116.71,55.02
  Bottom 0.61: v116.71,55.02 113.97,55.02 113.22,55.77 110.05,55.77 102.9,48.63 102.19,48.63 96.95,48.63 92.19,48.63 83.32,57.49 D5.3
  other vias: 83.32,58.85
G2_STICK2  (via drill 0.36)
  Top 0.61: J6.1 v1.7,66.13
  Bottom 0.61: v1.7,66.13 4.44,66.13 5.19,65.38 8.37,65.38 15.51,72.52 16.23,72.52 21.46,72.52 26.23,72.52 35.09,63.66 D7.3
  other vias: 35.09,62.3
G3  (via drill 0.36)
  Top 0.254: U1.15 73.52,35.94 73.3,36.17
  Top 0.406: 73.3,36.17 70.91,38.55 70.91,42.83 68.45,45.29 v63.29,45.29
  Bottom 0.406: JL.12 56.45,64.05 62.02,58.47 62.02,49.9 61.39,49.26 61.39,47.04 v63.29,45.29
G4  (via drill 0.36)
  Top 0.254: U7.19 39.94,39.91 39.72,40.13
  Top 0.406: 39.72,40.13 39.24,40.61 39.24,42.36 v39.72,42.83
  Bottom 0.406: v39.72,42.83 48.29,42.83 50.44,44.98 50.44,51.17 52.9,53.63 52.9,56.33 52.17,57.05 JL.5
G5  (via drill 0.36)
  Top 0.254: U7.17 41.19,41.68 40.99,41.88
  Top 0.406: v45.59,85.98 45.59,49.42 43.37,47.2 42.9,47.2 40.67,44.98 40.67,42.2 40.99,41.88
  Bottom 0.406: J7.1 40.59,101.5 40.99,101.09 40.99,91.09 45.28,86.74 45.59,86.43 v45.59,85.98
G6  (via drill 0.36)
  Top 0.254: U7.15 42.19,43.24 42.26,43.31
  Top 0.406: v50.1,85.73 49.59,85.22 49.56,47.28 47.74,45.45 43.53,45.45 42.26,44.18 42.26,43.31
  Bottom 0.406: J3.4 68.84,101.5 63.37,106.97 52.74,106.97 49.56,103.79 49.59,88.27 50.1,87.51 v50.1,85.73
G7
  Top 0.254: U8.19 46.53,10.94 46.86,10.61
  Top 0.406: 46.86,10.61 47.06,10.41 D1.3
G8  (via drill 0.36)
  Top 0.254: U8.17 44.76,9.54 45.28,9.02
  Top 0.406: D2.3 v45.91,1.26 | J4.2 v62.25,2.99 | 45.28,9.02 45.91,8.39 v45.91,6.16
  Bottom 0.406: v62.25,2.99 62.25,2.5 62.1,2.35 61.86,2.11 55.99,2.11 53.85,2.11 48.45,2.11 D2.3 v45.91,1.26 44.8,2.37 44.8,3.15 44.8,5.05 v45.91,6.16
G9  (via drill 0.36)
  Top 0.254: U8.15 43.76,8.32 v44.01,8.07
  Top 0.406: J4.5 v59.25,5.65 59.25,6 59.88,6.64 63.69,6.64 70.2,6.64 70.9,5.94 D3.3
  Bottom 0.406: v44.01,8.07 48.29,8.07 48.93,7.43 52.26,7.43 58.29,7.43 59.25,6.48 v59.25,5.65
GND  (via drill 0.36)
  Top 0.254: U8.20 44.12,11.44 v44.01,11.56 | U8.4 43.76,13.08 v44.01,12.83 U8.EP | U8.6 42.32,14.19 v41.78,14.73 | U7.4 42.19,37.34 v41.94,37.59 | U7.21 41.06,38.48 v41.31,38.23 | U7.6 43.19,35.71 43.53,35.37 v43.85,35.37 | U$2.15 73.49,13.73 v73.06,13.31 | U$2.23 77.89,15.94 | v65.44,18.23 65.44,19.02 65.78,19.36 U$2.5 | U$2.43 72.49,23.08 v72.11,23.47 | U$2.33 v78.93,21.36 | U$2.35 76.49,23.08 v76.87,23.47 | U1.21 77.41,34.81 v77.66,35.06 | U1.4 78.55,35.94 v78.3,35.69 | U1.20 76.91,35.58 v77.03,35.69 U1.EP | U1.6 80.66,36.94 v81.31,37.59
  Top 0.305: 77.89,15.94 77.89,15.14 78.3,14.73
  Top 0.406: v79.57,14.1 78.93,14.1 78.3,14.73
  Top 0.61: R26.2 v36.07,10.73 | C22.2 v44.13,19.5 | C21.2 v51.94,11.75 | D2.4 v52.58,4.66 | D2.5 v52.58,2.96 | D2.6 v52.58,1.26 | J4.9 v55.25,5.65 | J4.8 v56.25,5.65 | J4.7 v57.25,5.65 | D3.6 v65.91,4.66 | D3.5 v65.91,2.96 | D3.4 v65.91,1.26 | D1.6 v62.74,10.41 | D1.5 v62.74,12.11 | D1.4 v62.74,13.81 | C8.2 v34.64,30.61 | R24.2 v49.56,40.33 | v41.82,30.61 C18.2 | v41.94,37.59 U7.EP | v79.57,6.48 C2.2 | C10.2 v81.95,7.75 | v72.58,9.34 C6.1 | v94.65,88.82 U2.2 v92.43,88.82 | v79.57,14.1 SH1.2 | R1.2 v84.81,21.08 | C4.1 v65.44,18.23 | C1.2 v72.11,27.44 | R16.2 v75.68,43.95 | v86.55,35.53 C15.2 | v77.19,27.83 C14.2
  Bottom 0.406: v51.79,60.05 JL.8 | v67.5,60.05 JR.5
  Bottom 0.61: S1.1B 62.38,14.17 v62.74,13.81 | S1.1A 55.82,14.17 v55.12,14.86 | J3.1 v77.66,104.5 | J7.4 v40.83,104.5 | J5.3 v57.25,89.03
  other vias: 43.37,12.19 44.64,12.19 41.94,38.86 42.58,38.23 57.02,124.43 94.33,86.15 94.33,84.51 95.12,81.81 95.12,82.76 90.52,94.24 89.57,92.65 89.57,91.54 56.07,124.43 56.55,123.48 77.66,36.33
  pour GND (rank 2, no thermals): 31.86,-0.58 27.74,22.04 28.13,22.2 28.53,22.43 29.01,22.75 29.56,23.15 30.04,23.55 30.43,24.1 30.75,24.58 30.99,25.21 31.31,25.69 31.62,27.12 31.7,27.67 31.7,28.39 31.62,29.02 31.39,29.66 31.23,30.29 30.99,30.77 30.75,31.17 30.43,31.56 30.12,32.04 29.88,32.36 29.56,32.67 29.16,32.99 28.61,33.47 28.05,33.78 27.42,34.02 27.42,34.26 27.5,34.66 30.51,49.26 30.75,49.58 31.15,49.9 31.62,50.14 43.69,50.14 43.93,50.37 44.09,50.77 44.09,66.57 44.01,66.81 43.77,66.96 43.53,67.04 35.04,67.04 34.72,67.28 34.4,67.68 34.24,68.15 34.24,68.55 35.67,75.54 27.97,79.9 19.96,79.9 10.43,85.54 11.07,89.42 arc-40 27.89,114.91 28.45,114.83 29.88,114.83 30.59,114.99 31.23,115.14 31.94,115.38 32.58,115.7 33.05,116.02 33.45,116.34 33.93,116.81 34.32,117.37 34.8,118.08 35.2,118.8 35.43,119.59 35.79,120.67 38.52,122.5 arc-31 53.21,126.98 53.21,130.94 65.28,130.94 65.28,126.97 66.71,126.82 arc-29 82.28,120.93 82.82,120.54 82.9,120.22 82.98,119.67 83.22,118.88 83.62,118.08 84.01,117.61 84.33,117.13 84.96,116.49 85.6,116.02 86.39,115.54 87.27,115.14 88.22,114.91 89.09,114.83 91,114.83 92.64,113.34 arc-33 107.11,89.44 108.14,85.46 98.38,79.9 90.68,79.9 82.9,75.46 84.33,68.55 84.17,67.92 83.85,67.44 83.22,67.04 74.88,67.04 74.57,66.88 74.41,66.57 74.41,50.45 74.73,50.14 87.27,50.14 87.35,49.98 87.82,49.58 88.14,49.1 91.16,34.02 90.84,33.94 90.36,33.71 89.41,33.15 88.54,32.28 87.66,31.09 87.27,30.13 86.95,29.02 86.87,27.59 87.03,26.48 87.43,25.37 87.9,24.5 88.62,23.62 89.57,22.75 90.12,22.36 90.92,21.88 86.63,-0.58
  pour Top (no thermals): 92.74,83.6 92.74,86.62 92.9,86.78 95.44,86.78 95.6,86.62 95.6,81.7 95.44,81.54 92.9,81.54 92.9,83.44
  pour Top (no thermals): 91.95,94.55 90.2,94.55 89.09,93.13 89.09,91.54 89.41,91.22 91.63,91.22 91.63,93.13 91.95,93.6
  pour Top (no thermals): 57.82,126.97 57.82,125.22 57.5,124.91 55.91,124.91 55.6,124.59 55.6,123.32 55.91,123 57.66,123 58.01,123.48 58.01,126.97
GND_1LED
  pour Top (rank 2, no thermals): 18.21,27.51 22.34,27.51 22.34,23.07 21.23,21.96 21.23,20.21 22.81,18.62 22.81,17.83 22.34,17.35 18.69,17.35 18.21,17.83
GND_1LED2
  pour Top (rank 2, no thermals): 100.52,29.26 96.39,29.26 96.39,33.71 97.51,34.82 97.51,36.56 95.92,38.15 95.92,38.94 96.39,39.42 100.05,39.42 100.52,38.94
GND_POT  (via drill 0.36)
  Top 0.61: SH1.1 83.5,14.23 C11.2 v84.73,15.69 | R10.1 v59.25,56.57
  GND 0.406: 66.36,54.74 v66.61,54.99 66.61,55.06 66.7,55.06
  GND 0.813: v50.99,55.05 58.71,55.07 v59.25,56.57 | v60.25,87.6 59.25,86.6 v59.25,56.57 | v65.44,20.61 67.34,22.51 67.34,41.8 64.96,44.18 64.96,53.3 | 59.25,55.06 v59.25,56.57 | 66.7,55.06 66.71,55.05 64.96,53.3 | v59.25,56.57 63.22,55.05 64.96,53.3
  Bottom 0.406: v50.99,55.05 JL.3 | JR.10 v66.61,54.99
  Bottom 0.61: J5.6 v60.25,87.6 | v84.73,15.69 84.73,14.97 81.87,12.12 66.87,12.12 64.01,14.97 64.01,19.18 v65.44,20.61
GND_POT_STICK  (via drill 0.36)
  Top 0.61: J1.10 v115.76,64.02
  Bottom 0.61: v115.76,64.02 109.81,64.02 108.94,64.02 108.86,64.11 103.7,69.26 S2.8 100.16,62.64 99.17,61.65 99.17,59.66 100.8,58.03 S2.5
GND_POT_STICK2  (via drill 0.36)
  Top 0.61: J6.10 v2.65,57.13
  Bottom 0.61: v2.65,57.13 8.6,57.13 9.47,57.13 9.56,57.04 14.72,51.88 S3.8 18.25,58.51 19.24,59.5 19.24,61.49 17.61,63.11 S3.5
GND_STICK  (via drill 0.36)
  Top 0.61: J1.5 v116.71,59.02
  other vias: 108.53,58.82 108.53,62.22 86.82,58.85 86.82,60.55 86.82,62.25
  pour GND (rank 2, no thermals): 118.62,68.63 118.62,52.44 98.7,42.28 96.39,42.36 81.55,57.2 81.55,63.87 96.31,78.63 98.86,78.71
  pour Top (rank 2, no thermals): 109.41,58.55 107.67,58.55 107.67,62.52 109.41,62.52
  pour Top (rank 2, no thermals): 87.66,58.55 86,58.55 86,62.52 87.66,62.52
GND_STICK2  (via drill 0.36)
  Top 0.61: J6.5 v1.7,62.13
  other vias: 9.88,62.33 9.88,58.93 31.59,62.3 31.59,58.9 31.59,60.6
  pour GND (rank 2, no thermals): -0.2,52.52 -0.2,68.71 19.72,78.87 22.02,78.79 36.86,63.95 36.86,57.28 22.1,42.52 19.56,42.44
  pour Top (rank 2, no thermals): 9,62.6 10.75,62.6 10.75,58.63 9,58.63
  pour Top (rank 2, no thermals): 30.75,62.6 32.42,62.6 32.42,58.63 30.75,58.63
HOR_C  (via drill 0.36)
  Top 0.254: U$2.38 74.99,27.46 v75.36,27.83
  Bottom 0.406: J5.9 63.25,62.8 65.6,60.45 65.6,59.26 65.6,58.39 65.6,51.25 65.6,43.95 67.74,41.8 67.74,32.91 67.74,31.64 69.64,29.74 70.91,29.74 72.42,29.74 73.93,29.74 74.8,29.74 75.36,29.18 v75.36,27.83
HOR_C_STICK
  Top 0.61: J1.11 108.81,65.02 102.11,71.73 98.78,71.73 97.82,70.77 97.66,70.62 S2.9
HOR_C_STICK2
  Top 0.61: J6.11 9.6,56.13 16.3,49.42 19.64,49.42 20.59,50.37 20.75,50.53 S3.9
HOR_L  (via drill 0.36)
  Top 0.254: U$2.36 75.99,23.7 v76.87,24.5
  Top 0.406: v51.84,54.05 52.74,53.15 v52.74,49.92
  Bottom 0.406: v76.87,24.5 69.33,24.5 65.44,28.39 55.12,28.39 50.44,33.07 50.44,41.64 52.74,43.95 v52.74,49.92 | v51.84,54.05 JL.2
HOR_R  (via drill 0.36)
  Top 0.254: U$2.40 73.99,27.94 73.77,28.15
  Top 0.406: v73.61,30.61 73.61,28.31 73.77,28.15
  Bottom 0.406: v73.61,30.61 71.55,30.61 69.17,32.99 69.17,42.83 68.06,43.95 68.09,51.49 67.48,52.05 66.46,52.61 66.46,53.77 67.02,54.03 JR.11
IRQ
  Top 0.254: U$2.29 79.59,19.36 81.31,21.08 R1.1
LED_EN_1_3
  Top 0.254: 83.67,37.28 R17.1 | U1.5 81.75,36.44 82.11,36.8
  Top 0.406: R17.1 82.58,37.28 82.11,36.8
LED_EN_4_6
  Top 0.254: U7.5 42.69,35.26 43.69,34.26 43.69,33.4 R25.1
LED_EN_7_9
  Top 0.254: U8.5 43.26,14.85 42.42,15.69 42.23,15.88 R27.1
MISO
  Top 0.254: J2.1 57,25.23 57.98,24.26 57.98,17.91 58.61,17.28 62.04,17.28 63.95,15.37 70.04,15.37 71.03,16.36 U$2.11
MOSI
  Top 0.254: U$2.10 70.58,16.86 70.2,16.48 64.33,16.48 59.25,21.56 J2.4
N$1
  Top 0.254: U$2.16 73.99,13.17 74.96,12.19 77.03,12.19 77.34,11.88 77.34,9.66 76.55,8.86 | 76.55,8.86 76.17,8.86 Y1.1 | C2.1 76.63,6.48 76.63,8.23 76.55,8.23 76.55,8.86
N$2
  Top 0.254: U$2.17 74.49,13.62 75.28,12.83 77.34,12.83 77.98,12.19 77.98,11.08 78.26,10.81 Y1.3 80.04,10.81 80.04,10.61 81.95,10.61 C10.1
N$3  (via drill 0.36)
  Top 0.254: U1.7 78.91,38.21 79.09,38.39
  Top 0.406: 79.09,38.39 79.33,38.63 v80.6,38.63
  Bottom 0.406: v80.6,38.63 81.55,38.63 82.19,37.99 82.19,36.8 81.87,36.48 81.87,34.9 83.3,33.47 TP1.1
N$4
  Top 0.254: U$2.6 69.41,18.86 68.93,18.39 68.42,18.39 C4.2
N$5
  Top 0.254: U7.2 41.19,35.58 39.88,34.26 39.88,33.65 C19.1
N$7
  Top 0.61: R7.3 64.5,95.3 66.1,96.9 76.77,96.9 77.28,96.4 77.65,96.06 82.48,90.47 R6.1
N$9
  Top 0.254: U7.24 39.26,36.98 39.09,36.8
  Top 0.406: C19.2 38.51,31.67 38.13,32.04 38.13,35.06 38.13,35.85 39.09,36.8
N$10
  Top 0.61: R7.1 53.77,95.3 52.26,93.79 52.26,91.25 59.25,84.27 R10.2
N$11
  Top 0.254: U1.2 81.59,34.94 81.95,34.58
  Top 0.406: 81.95,34.58 83.06,33.47 C16.1
N$12
  Top 0.254: U1.24 79.34,33.69 79.57,33.47
  Top 0.406: 79.57,33.47 81,32.04 85.02,32.04 85.5,32.52 C16.2
N$13  (via drill 0.36)
  Top 0.254: U1.1 80.5,34.44 80.84,34.1
  Top 0.406: C17.1 v81.31,28.97 | v81.31,33.31 80.84,34.1
  Bottom 0.406: v81.31,33.31 v81.31,28.97
N$14
  Top 0.254: U1.23 78.41,33.03 78.77,32.67
  Top 0.406: 78.77,32.67 79.25,32.2 C17.2
N$21  (via drill 0.36)
  Top 0.254: U7.1 40.69,35.87 40.04,35.21 v39.56,35.21
  Top 0.406: C20.1 v36.7,30.61
  Bottom 0.406: v36.7,30.61 36.7,32.36 v39.56,35.21
N$22
  Top 0.254: U7.23 38.49,37.48 38.29,37.28
  Top 0.406: C20.2 36.7,34.42 36.7,35.69 38.29,37.28
N$23
  Top 0.254: U7.7 44.3,36.98 44.64,36.64
  Top 0.406: 44.64,36.64 44.96,36.33 45.12,36.17 45.12,33.78 TP2.1
N$24
  Top 0.254: U8.2 44.76,14.85 45.59,15.69 45.59,15.98 C23.1
N$25  (via drill 0.36)
  Top 0.254: U8.24 46.53,13.44 46.86,13.78 v46.86,14.1
  Top 0.61: C23.2 v46.36,19.5
  Bottom 0.406: v46.86,14.1 46.86,18.99 v46.36,19.5
N$26
  Top 0.254: C25.1 50.89,14.52 50.67,14.73 50.36,15.05 47.5,15.05 45.91,15.05 45.26,14.4 U8.1
N$27
  Top 0.254: U8.23 46.98,12.94 47.82,13.78 47.9,13.87 C25.2
N$28
  Top 0.254: U8.7 41.49,13.44 40.51,14.42 40.51,14.73
  Top 0.406: 40.51,14.73 40.51,16.96 39.88,17.59 TP3.1
R1  (via drill 0.36)
  Top 0.254: U1.13 74.74,36.94 74.57,37.12
  Top 0.406: 74.57,37.12 72.34,39.34 72.34,44.1 v70.44,46.01
  Bottom 0.406: v67.5,58.05 JR.7 69.11,58.05 69.66,58.05 | 69.66,58.05 69.91,58.04 | v70.44,46.01 70.27,46.87 70.27,50.32 70.57,50.78 70.57,53.16 71.69,53.98 71.69,57.28 70.68,58.04 69.66,58.05
R1_1LED
  Top 0.61: D8.2 20.29,33.44 R18.1
R1_1LED2
  Top 0.61: D9.2 98.44,23.34 R19.1
R1_STICK
  pour Top (no thermals): 114.89,60.85 113.3,60.85 112.9,60.45 112.9,60.06 111.16,60.06 111.16,61.01 112.98,61.01 113.22,61.19 114.89,61.19
R1_STICK2
  pour Top (no thermals): 3.53,60.3 5.11,60.3 5.51,60.69 5.51,61.09 7.26,61.09 7.26,60.14 5.43,60.14 5.19,59.95 3.53,59.95
R2  (via drill 0.36)
  Top 0.254: 75.66,37.69 U1.12
  Top 0.406: 75.66,37.69 75.42,37.69 73.06,40.06 v73.06,45.06
  Route15 0.406: v71.84,62.2 72.45,61.09 v72.44,50.52
  Bottom 0.406: JR.2 70.22,63.05 v71.84,62.2 | v72.44,50.52 73.06,50.22 v73.06,45.06
R2_STICK  (via drill 0.36)
  Top 0.61: J1.2 v115.76,56.02
  Bottom 0.61: v115.76,56.02 114.48,56.02 113.86,56.65 109.41,56.65 104.89,52.12 102.66,52.12 97.51,52.12 90.12,52.12 85.12,57.12 85.12,59.98 84.56,60.55 D5.2
  other vias: 83.32,60.55
R2_STICK2  (via drill 0.36)
  Top 0.61: J6.2 v2.65,65.13
  Bottom 0.61: v2.65,65.13 3.93,65.13 4.56,64.5 9,64.5 13.53,69.03 15.75,69.03 20.91,69.03 28.29,69.03 33.29,64.03 33.29,61.17 33.86,60.6 D7.2
  other vias: 35.09,60.6
R3  (via drill 0.36)
  Top 0.254: U1.11 76.91,38.34 76.55,38.71 76.07,38.71 75.92,38.86
  Top 0.406: v59.88,47.04 72.58,47.04 74.41,45.22 74.41,40.37 75.92,38.86
  Bottom 0.406: JL.11 54.43,63.05 56.47,61.01 56.47,48.63 58.06,47.04 v59.88,47.04
R4  (via drill 0.36)
  Top 0.254: U7.13 43.19,41.62 v43.53,41.96
  Bottom 0.406: v43.53,41.96 48.53,41.96 51.15,44.58 51.15,50.77 53.61,53.23 53.61,57.36 52.92,58.05 JL.6
R5  (via drill 0.36)
  Top 0.254: U7.12 44.3,39.48 44.48,39.66 44.48,41.72
  Top 0.406: v46.39,86.97 46.39,49.02 v44.48,47.12 | 44.48,41.72 v44.48,43.71
  Bottom 0.406: J7.2 41.33,102.5 41.94,101.89 41.94,91.41 v46.39,86.97 | v44.48,47.12 v44.48,43.71
R6  (via drill 0.36)
  Top 0.254: U7.11 44.6,38.98 45.12,39.5 45.12,41.01 45.28,41.17
  Top 0.406: v48.77,48.07 v48.83,87 | v47.82,43.71 45.28,41.17
  Bottom 0.406: J3.3 69.27,102.5 63.85,107.92 52.42,107.92 48.77,104.27 48.83,88.01 v48.83,87 | v47.82,43.71 47.82,47.12 v48.77,48.07
R7  (via drill 0.36)
  Top 0.254: U8.13 42.76,9.67 v42.42,9.34
  Top 0.406: D1.2 56.3,12.11 v53.21,12.11
  Bottom 0.406: v42.42,9.34 43.37,10.29 49.72,10.29 52.26,10.29 53.21,11.24 v53.21,12.11
R8  (via drill 0.36)
  Top 0.254: U8.12 41.78,10.94 41.49,10.94 41.47,10.92 41.15,10.61 41.15,10.29
  Top 0.406: D2.2 v45.91,2.96 45.3,2.96 42.1,6.16 41.78,6.48 41.15,7.11 41.15,10.29 | J4.3 v61.25,2.99
  Bottom 0.406: v45.91,2.96 47.47,2.96 48.32,3.81 51.94,3.81 53.53,3.81 54.36,2.99 v61.25,2.99
R9  (via drill 0.36)
  Top 0.254: U8.11 41.35,11.44 40.2,10.29 v40.2,7.11
  Top 0.406: D3.2 72.56,2.96 73.22,3.62 73.22,6.16 72.26,7.11 71.95,7.43 64.33,7.43 59.25,7.43 58.25,6.43 v58.25,5.65 J4.6
  Bottom 0.406: v40.2,7.11 45.44,7.11 47.98,7.11 48.45,6.64 52.26,6.64 57.66,6.64 58.25,6.05 v58.25,5.65
RESET  (via drill 0.36)
  Top 0.254: U$2.13 72.49,14.8 71.95,14.26 71.15,14.26 70.38,13.49 | 70.38,13.49 R2.2 | RST.PAD 69.61,14.26 70.38,13.49
  Top 0.406: v59.25,15.77 62.41,15.77 63.82,14.35 66.87,14.35 RST.PAD
  Bottom 0.254: J2.5 60.52,23.96 60.52,19.81 59.25,18.55 v59.25,15.77
  Bottom 0.406: S1.2A v59.25,15.77 S1.2B
SCK
  Top 0.254: U$2.9 70.29,17.36 70.04,17.12 68.77,17.12 64.64,17.12 60.52,21.24 60.52,22.04 60.52,23.96 J2.3
SCL  (via drill 0.36)
  Top 0.254: U$2.18 74.99,14.08 75.44,13.62 v75.92,13.62 | U1.9 77.91,39.49 v77.26,40.13 | U7.9 45.5,37.98 45.69,37.91
  Top 0.406: v77.26,40.13 R13.1 | v63.29,47.91 v74.88,47.91 | 45.69,37.91 45.94,37.56 46.17,37.34 | 46.17,37.34 49.09,34.42 49.09,26.8 47.31,25.02 37.15,25.02 34.61,22.48 34.61,15.88 v35.37,15.12 | v35.37,12.32 R8.2 | v47.56,37.72 46.55,37.72 46.17,37.34
  Route15 0.406: v63.29,47.91 57.75,47.91 51.88,42.04 51.88,39.5 50.61,38.23 48.07,38.23 v47.56,37.72
  Bottom 0.406: J5.2 56.25,66.47 63.45,59.26 63.45,48.07 v63.29,47.91 | v75.92,13.62 75.92,14.42 76.55,15.05 80.04,15.05 80.52,14.58 81.79,14.58 83.06,15.85 83.06,24.58 79.57,28.07 79.57,37.12 77.26,39.42 v77.26,40.13 77.26,45.53 v74.88,47.91 | v35.37,15.12 v35.37,12.32
SCL2
  Top 0.254: U8.9 40.45,12.44 40.32,12.32 R8.1
SDA  (via drill 0.36)
  Top 0.254: U$2.19 75.49,14.85 75.92,14.42 76.71,14.42 77.03,14.1 v77.03,13.62 | U1.8 78.41,39.54 v79.01,40.13 | U7.8 45.07,37.48 45.32,37.23
  Top 0.406: v79.01,40.13 R14.1 | v79.01,45.53 75.76,48.79 v62.26,48.79 | 45.32,37.23 46.04,36.52 46.04,36.45 46.17,36.33 46.29,36.2 | 46.29,36.2 48.07,34.42 48.07,27.05 46.8,25.78 36.64,25.78 33.85,22.99 33.85,15.12 34.86,13.85 37.25,13.85 R15.2 | v46.29,35.44 46.29,36.2
  Route15 0.406: v62.26,48.79 57.36,48.79 51.12,42.55 51.12,40.01 50.1,38.99 v46.55,38.99
  Bottom 0.406: J5.1 55.25,66.36 62.74,58.87 62.74,49.26 v62.26,48.79 | v77.03,13.62 77.5,13.15 81.63,13.15 83.85,15.37 83.85,24.89 80.36,28.39 80.36,37.59 79.01,38.94 v79.01,40.13 v79.01,45.53 | v46.55,38.99 46.55,35.69 v46.29,35.44
SDA2
  Top 0.254: U8.8 41.03,12.94 40.07,13.91 R15.1
SEL_C  (via drill 0.36)
  Top 0.254: U$2.27 v81.31,18.36
  Bottom 0.406: J5.7 61.25,67.03 61.25,62.58 64.17,59.66 64.17,59.42 64.17,51.25 64.17,43.15 66.31,41.01 66.31,39.26 66.31,34.58 66.31,32.12 66.31,30.85 68.85,28.31 70.12,28.31 72.58,28.31 73.93,26.96 75.2,26.96 77.34,26.96 77.98,26.96 81.31,23.62 81.31,23.07 v81.31,18.36
SEL_C_STICK  (via drill 0.36)
  Top 0.61: R11.1 v92.58,71.73 | v115.76,58.02 J1.4
  Bottom 0.61: v115.76,58.02 117.14,58.02 117.67,58.55 117.67,59.19 117.67,63.99 116.63,65.02 109.69,65.02 102.98,71.73 97.82,71.73 v92.58,71.73 92.58,68.31 95.84,65.06 95.84,56.21 S2.1
SEL_C_STICK2  (via drill 0.36)
  Top 0.61: R12.1 v25.83,49.42 | v2.65,63.13 J6.4
  Bottom 0.61: v2.65,63.13 1.28,63.13 0.75,62.6 0.75,61.96 0.75,57.16 1.78,56.13 8.73,56.13 15.43,49.42 20.59,49.42 v25.83,49.42 25.83,52.84 22.58,56.09 22.58,64.94 S3.1
SEL_L  (via drill 0.36)
  Top 0.254: U$2.31 79.24,20.36 79.73,20.85 v79.73,23.47
  Bottom 0.406: JL.9 53.33,61.05 55.04,59.34 55.04,49.18 54.48,48.63 54.48,43.47 51.86,40.85 51.86,33.86 55.83,29.9 66.15,29.9 69.8,26.24 76.95,26.24 v79.73,23.47
SEL_R  (via drill 0.36)
  Top 0.254: 70.12,23.94 70.12,22.59 71.09,21.63 U$2.1
  Top 0.406: 70.12,23.94 v70.12,30.61 | v66.19,61.05 65.6,60.45 65.6,52.44 v66.71,51.33
  Bottom 0.406: v70.12,30.61 68.45,32.28 68.45,42.44 67.34,43.55 67.34,50.69 v66.71,51.33 | JR.4 v66.19,61.05
TRIG_1_3
  Top 0.254: U1.10 77.41,38.72 76.31,39.82
  Top 0.406: 76.31,39.82 75.68,40.45 R16.1
TRIG_4_6
  Top 0.254: U7.10 45.05,38.48 45.36,38.79
  Top 0.406: R24.1 46.1,40.33 45.75,39.98 45.75,39.18 45.36,38.79
TRIG_7_9
  Top 0.254: U8.10 41.22,11.94 40.2,10.92 40.01,10.73 R26.1
USB_N
  Top 0.406: USB1.2 59.9,125.15 59.9,122.71 57.95,120.77 51.47,120.77 50.81,120.77 49.26,119.21 49.26,115.06 49.26,89.8 55.45,83.61 55.45,78.39 55.45,46.27 51.24,42.06 51.24,39.42 51.24,33.29 55.34,29.19 62.02,29.19 64.3,29.19 67.51,25.98 67.51,25.91 67.51,25.05 67.51,24.7 R5.1
USB_P
  Top 0.406: USB1.3 59.25,125.15 59.25,122.99 57.68,121.43 51.47,121.43 50.54,121.43 48.6,119.49 48.6,115.06 48.6,89.53 54.79,83.34 54.79,78.39 54.79,46.54 50.58,42.34 50.58,39.42 50.58,33.01 55.06,28.53 62.02,28.53 64.03,28.53 66.85,25.71 66.85,25.63 66.85,25.05 66.85,24.7 R9.1
UVCC  (via drill 0.36)
  Top 0.254: U$2.7 70.18,18.36 v69.88,18.07 | U$2.2 70.42,20.86 69.88,21.4 v69.88,21.56
  Top 0.61: 61.07,119.35 52.26,119.35 50.91,118 50.91,90.22 56.47,84.66 56.47,45.61 52.1,41.25 52.1,33.78 55.83,30.05 64.88,30.05 69.33,25.61 69.33,22.12 v69.88,21.56
  Bottom 0.406: v69.88,18.07 v69.88,21.56
  pour Top (no thermals): 91.47,95.19 91.47,97.57 94.49,100.59 94.49,102.33 95.12,108.87 90.36,113.64 88.14,113.64 87.03,113.95 85.76,114.43 84.17,115.54 83.06,116.81 82.11,118.4 81.79,119.67 80.52,120.46 79.57,120.94 76.87,122.21 75.28,122.84 72.74,123.8 68.93,124.91 60.99,124.91 60.68,125.22 60.68,126.97 60.48,126.97 60.64,119.23 61.15,118.72 65.76,118.72 66.87,117.61 66.87,111.73 70.04,108.56 78.9,108.56 81.38,102.78 81.38,95.16 89.73,95.19
VER_C  (via drill 0.36)
  Top 0.254: U$2.39 74.49,27.83 v74.49,28.7
  Bottom 0.406: J5.8 62.25,62.69 64.88,60.06 64.88,56.96 64.88,51.25 64.88,43.55 67.03,41.41 67.03,32.52 67.03,31.25 69.25,29.02 70.52,29.02 74.17,29.02 v74.49,28.7
VER_C_STICK  (via drill 0.36)
  Top 0.61: J1.9 v116.71,63.02
  Bottom 0.61: S2.6 109.97,60.53 112.11,62.68 112.45,63.02 v116.71,63.02
VER_C_STICK2  (via drill 0.36)
  Top 0.61: J6.9 v1.7,58.13
  Bottom 0.61: S3.6 8.45,60.61 6.3,58.47 5.96,58.13 v1.7,58.13
VER_L  (via drill 0.36)
  Top 0.254: U$2.37 75.49,24.86 v75.76,25.37
  Top 0.406: v51.7,56.05 52.9,56.01 53.77,54.74 v53.77,49.94
  Bottom 0.406: v53.77,49.94 53.77,43.87 51.15,41.25 51.15,33.47 55.52,29.1 65.83,29.1 69.57,25.37 v75.76,25.37 | v51.7,56.05 JL.4
VER_R  (via drill 0.36)
  Top 0.254: U$2.41 73.49,27.4 73.06,27.83
  Top 0.406: v72.74,31.48 72.74,28.15 73.06,27.83 | v67.37,56.01 68.64,56.01 68.85,55.25 v68.85,51.9
  Bottom 0.406: v72.74,31.48 71.79,31.48 69.88,33.39 69.88,43.23 68.77,44.34 68.8,51.69 | JR.9 v67.37,56.01 | 68.8,51.69 68.8,51.9 | v68.85,51.9 68.8,51.69
VOUT_1_3
  Top 0.254: U1.22 77.91,32.92 77.66,32.67
  Top 0.406: 77.66,32.67 77.19,32.2 C14.1
VOUT_3_6
  Top 0.254: U7.22 37.72,37.98 37.5,37.75
  Top 0.406: C8.1 34.64,34.9 37.5,37.75
VOUT_7_9
  Top 0.254: U8.22 47.57,12.44 48.26,11.75 C21.1
VUSB_FUSED  (via drill 0.36)
  Top 0.254: U8.3 44.26,15.56 v44.13,15.69 | U7.3 41.69,34.54 v41.82,34.42 | U1.3 80.59,35.44 80.68,35.53
  Top 0.406: v44.13,15.69 C22.1 | C18.1 v41.82,34.42 | 80.68,35.53 v82.74,35.53 C15.1
  Route15 0.813: v62.74,27.28 v63.69,27.28 | v82.74,35.53 80.92,35.53 78.77,37.67 68.77,37.67 68.77,37.52 | v58.25,87.76 60.39,85.62 v68.77,85.62
  Route15 1.27: v63.69,27.28 67.26,27.28 68.77,28.78 68.77,37.52 68.77,44.66 65.85,47.88 63.56,50.17 63.56,63.63 68.77,68.84 v68.77,85.62 v74.17,90.46
  Bottom 0.406: v41.82,34.42 42.74,33.5 42.74,29.9 45.36,27.28 43.21,25.13 43.21,16.61 v44.13,15.69
  Bottom 0.61: J5.4 v58.25,87.76
  Bottom 0.813: v63.69,27.28 v62.74,27.28 45.36,27.28
  Bottom 1.27: v95.76,90.27 v94.65,90.27 94.24,90.52 91,90.55 89.73,89.79 87.82,90.46 v74.17,90.46 v68.77,85.62
  pour Top (no thermals): 93.22,97.25 94.49,98.52 96.87,98.52 97.51,97.41 97.82,96.62 97.82,88.05 97.19,87.41 93.06,87.41 93.06,88.05 95.12,88.05 95.44,88.36 95.44,89.32 95.12,89.63 93.06,89.63 93.06,94.87 93.22,95.03
WHEEL  (via drill 0.36)
  Top 0.254: U$2.25 79.96,17.36 80.84,16.48 v80.84,15.69
  Top 0.406: C11.1 v80.84,15.69 | R7.2A 55.6,105.55 55.6,101.25 59.25,97.6 R7.2 59.25,91.57 61.23,89.59 61.23,55.14 v66.47,49.9 | v74.25,32.2 74.09,32.36 72.18,32.36 70.91,32.36 69.88,33.39 69.88,37.67 69.88,41.01 v66.47,44.42
  Bottom 0.406: v80.84,15.69 82.19,17.04 82.19,20.45 82.19,23.86 82.19,24.26 v74.25,32.2 | v66.47,44.42 v66.47,49.9

## Text on the board
tNames: PLA_G2R4 | EHMC | F1 | C7 | C5 | U2 | C24 | C3 | C9 | PLA_G2R2_S | PLA_G2R2_S | G | GND | R | B | R9 | R5 | C1 | PLA_G2R2_L | R1 | PLA_G2R2_L | B | R | GND | G | C4 | RST | Y1 | R2 | C6 | C10 | C2
bNames: MISO | SCK | RESET | J2 | 3V3 | MOSI | GND | PLA_G2R2_M
Document: FILES | Board stackup (mm) / / Layer 1 0.035 foil thickness / Bonding ply 0.3 Dielectric Constant 4.5 (+/- 0.10) / Layer 2 0.035 foil thickness / Laminate Core 0.85 Dielectric Constant 4.5 (+/- 0.10) / Layer 3 0.035 foil thickness / Bonding ply 0.3 Dielectric Constant 4.5 (+/- 0.10) / Layer 4 0.035 foil thickness / / Total Thickness 1.59 | NOTES: | 1. PRINTED CIRCUIT BOARD MADE FROM NEMA GRADE FR-4 EPOXY LAMINATE | WITH 1 OUNCE COPPER PLATING AND .063 THICKNESS. | DRL =DRILL TOOL SIZE INFORMATION (INCHES) / DRD =JOB DRILL DATA (NC DRILL LOCATION INFO) / OLN =OUTLINE / L1 =TOP LAYER (POS LAYER) / SLK=SILKSCREEN TOP / BSK=SILKSCREEN BOT / SMT=SOLDER MASK TOP / SMB=SOLDER MASK BOT / L2 =INNER LAYER 1 / L3 =INNER LAYER 2 / L4 =BOT LAYER / TPS=TOP STENCIL / BPS=BOTTOM STENCIL / MNT=PLACE FILE TOP / MNB=PLACE FILE BOTTOM / BOM= BILL OF MATERIALS / SCHEMATIC / FABDRAWING | 2. ALL DIMENSIONS ARE GIVEN IN INCHES. | 3. CIRCUIT PATHS ARE FOR REFERENCE ONLY. | 4. HOLE SIZES SHOWN ARE FINISHED DIAMETERS AFTER PLATING. | 5. BOARD PLATED USING REFLOW OR SIMILAR METHOD. | 6. APPLY GREEN SOLDER MASK ON PLATED SURFACES USING WET FILM SR100 | OR SR1010 EPOXY. EQUIVALENT WET OR DRY FILM MAY BE USED. | 7. SILKSCREEN TOP and BOTTOM SIDE USING WHITE INK. | 8. THE FOLLOWING INFORMATION APPLIES TO THIS BOARD: | A) 4 COPPER LAYERS | B) 0.063 BOARD THICKNESS | C) REQUIRES TOP AND BOTTOM SILKSCREEN